# EAGLE schematic Schematic (EAGLE 9.6.0)
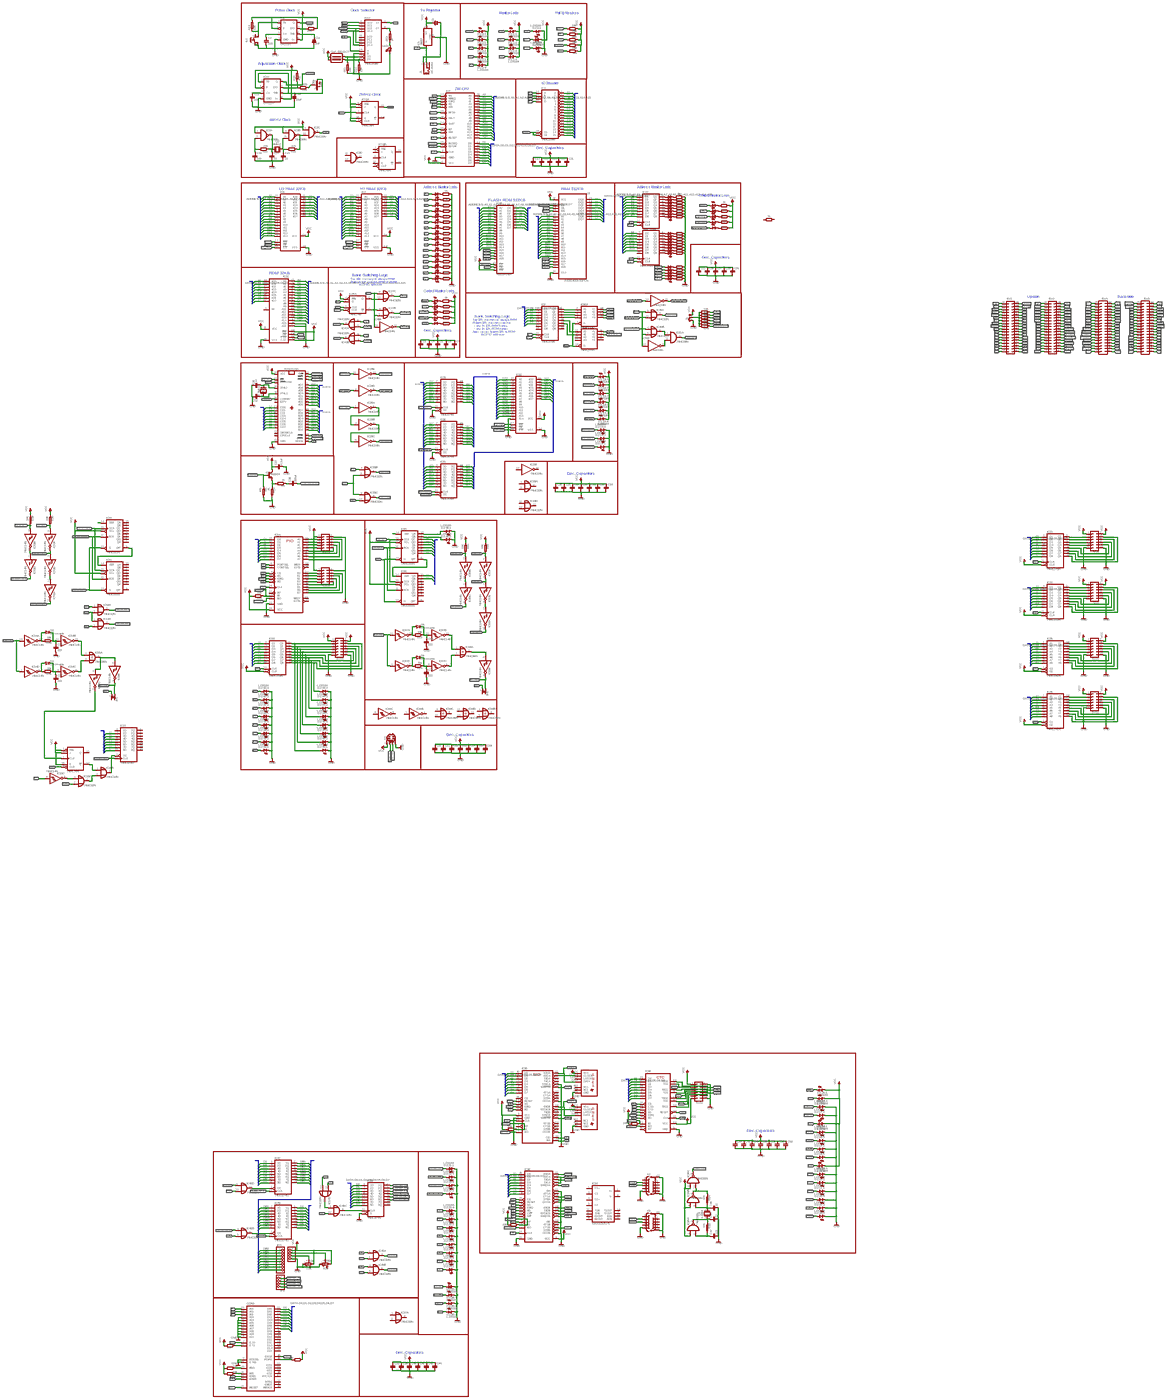
[diagram p0: schematic, sheet 1, overview]
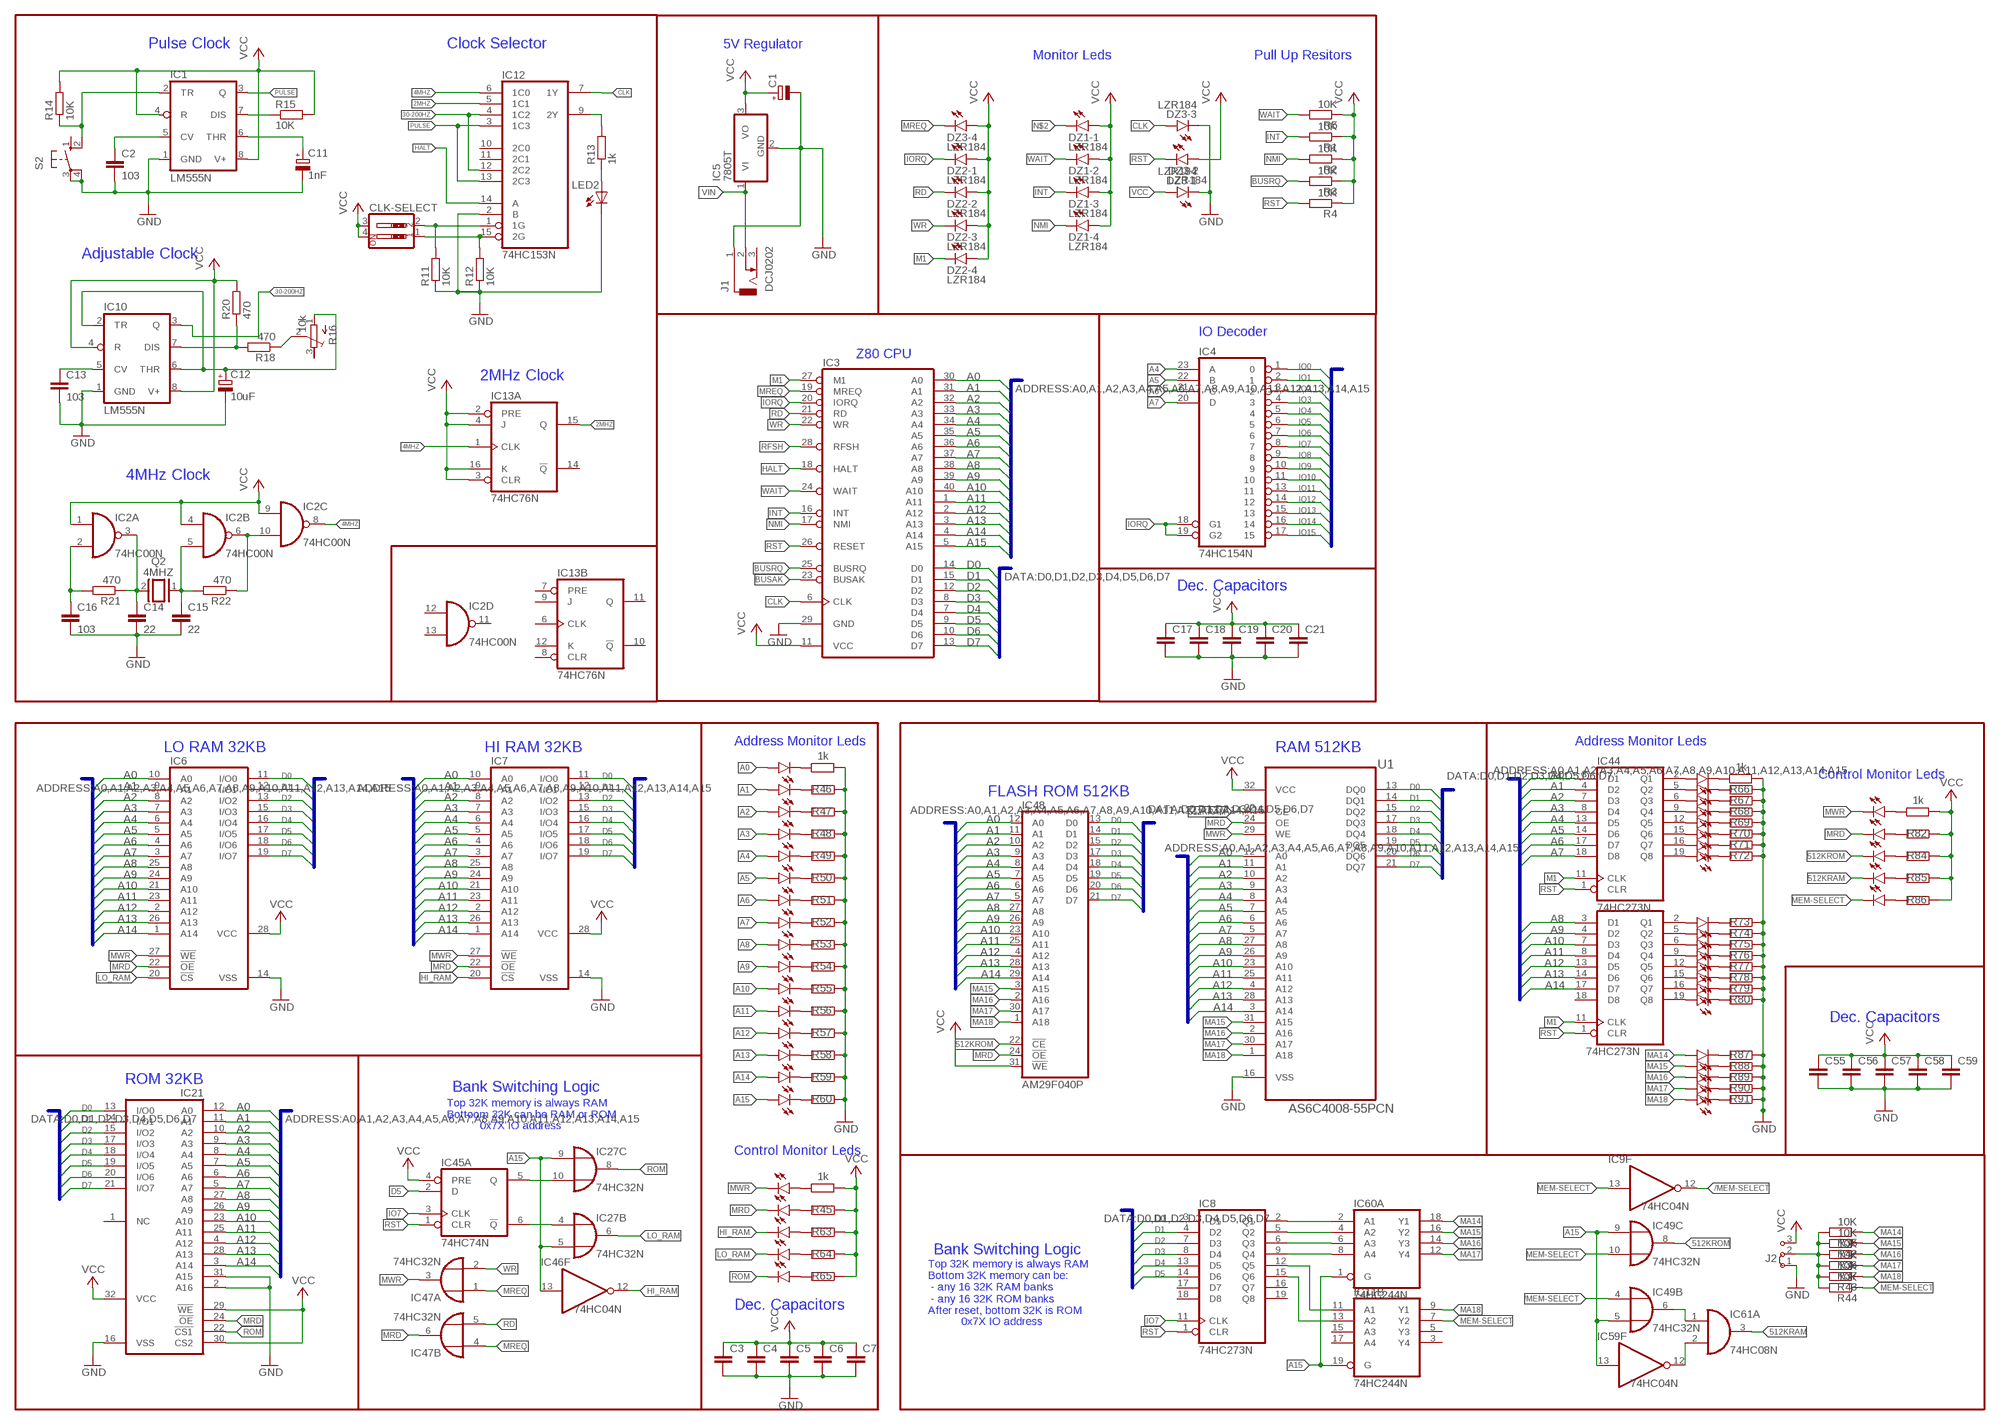
[diagram p1: schematic, sheet 1, part 1 of 7]
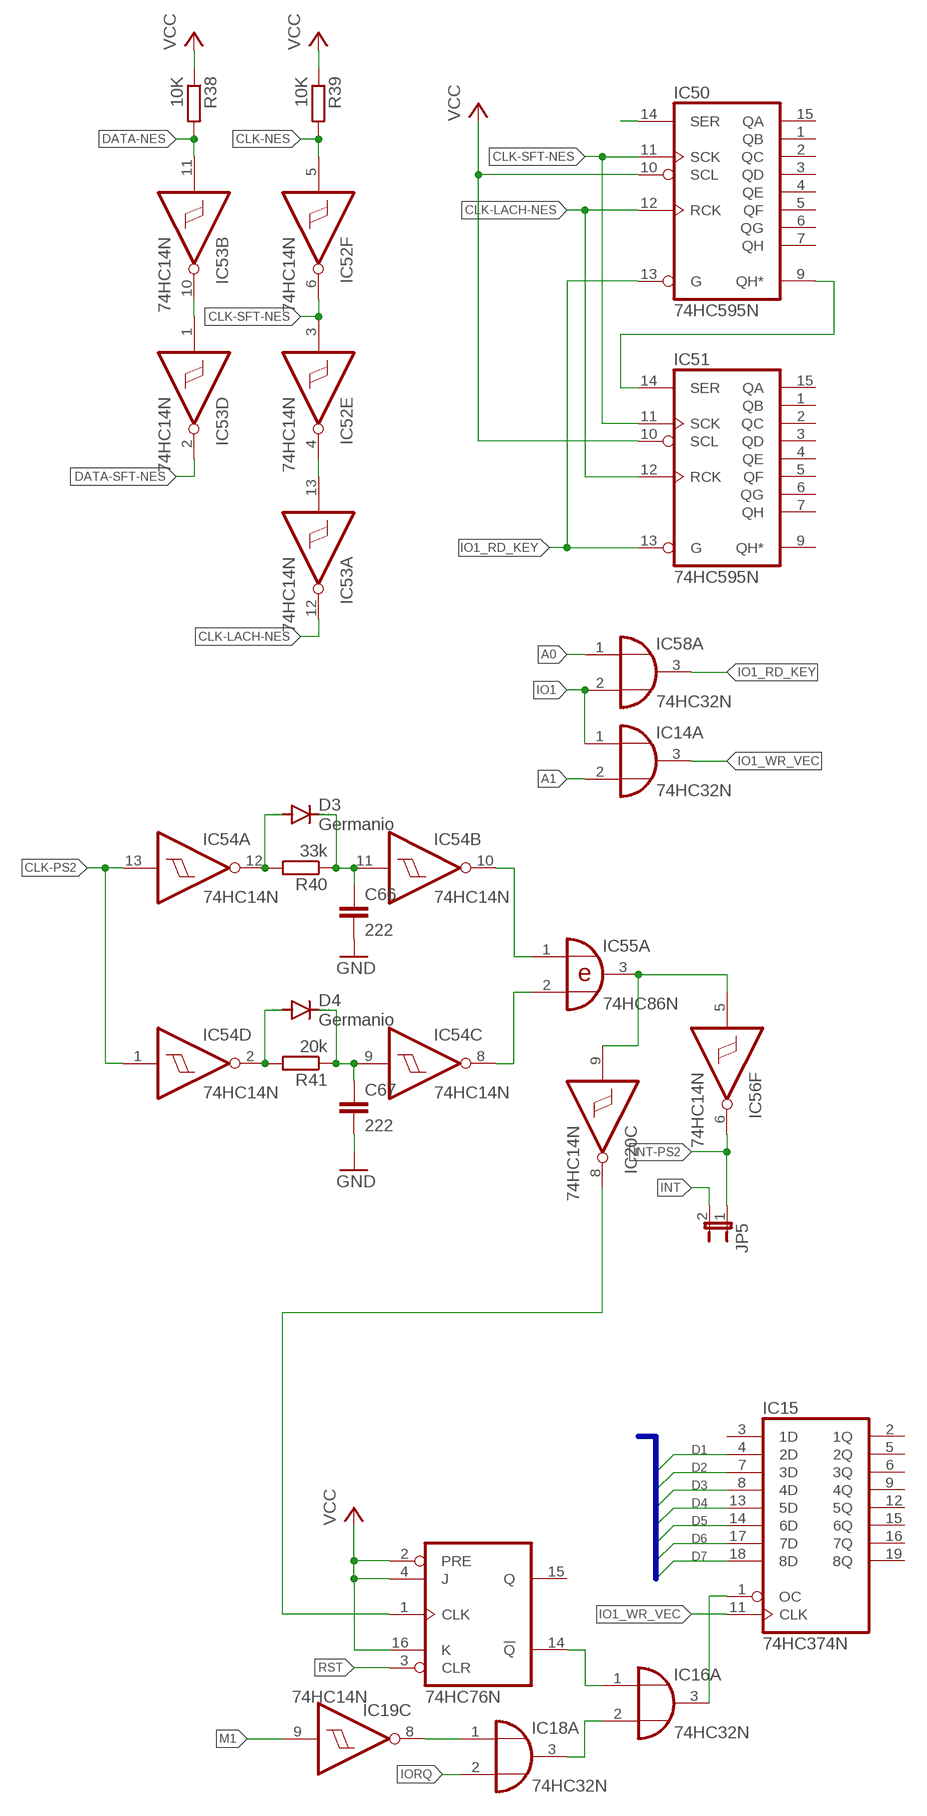
[diagram p2: schematic, sheet 1, part 2 of 7]
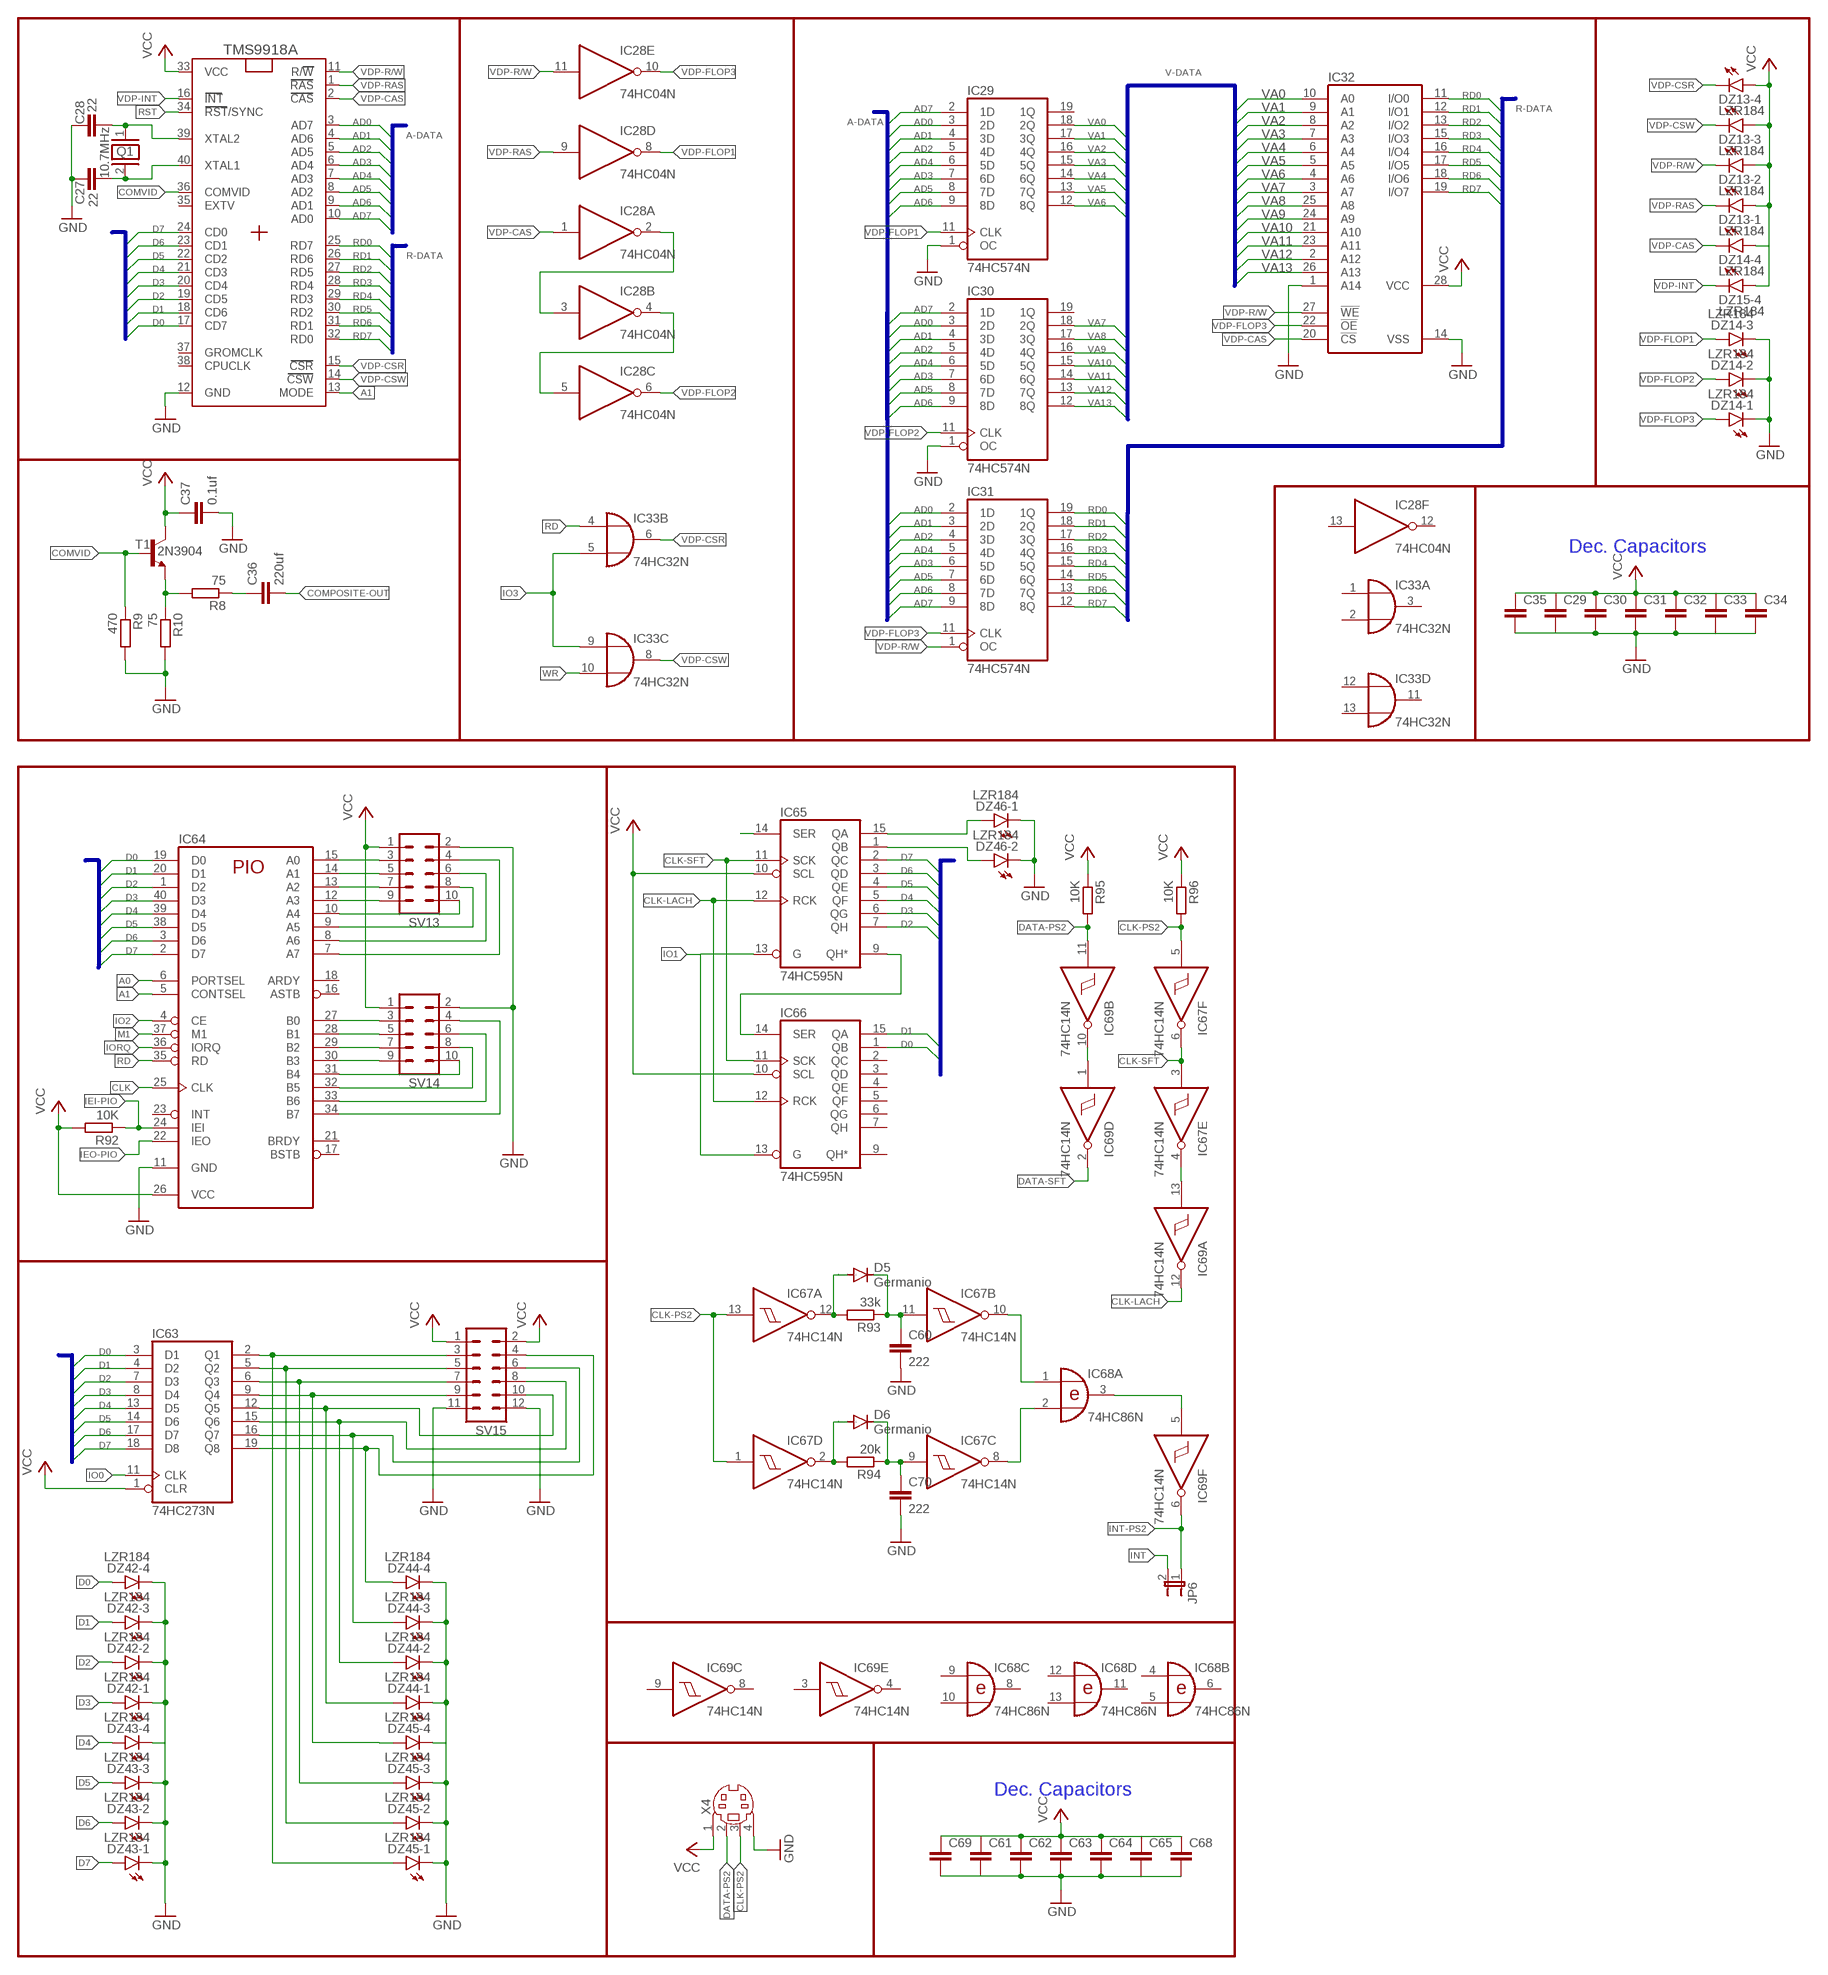
[diagram p3: schematic, sheet 1, part 3 of 7]
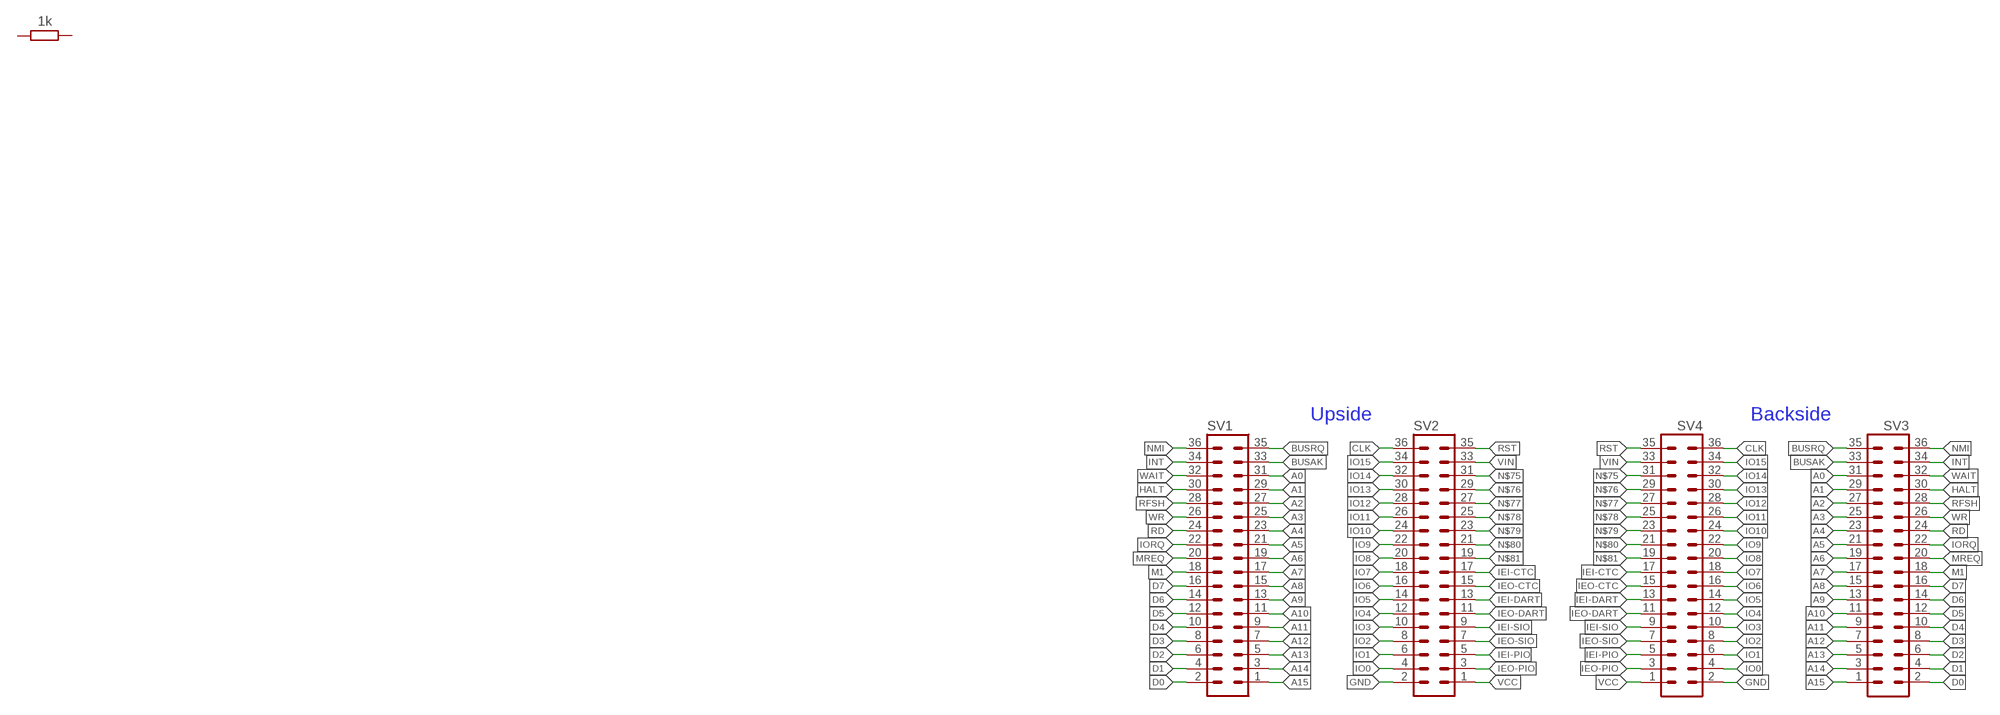
[diagram p4: schematic, sheet 1, part 4 of 7]
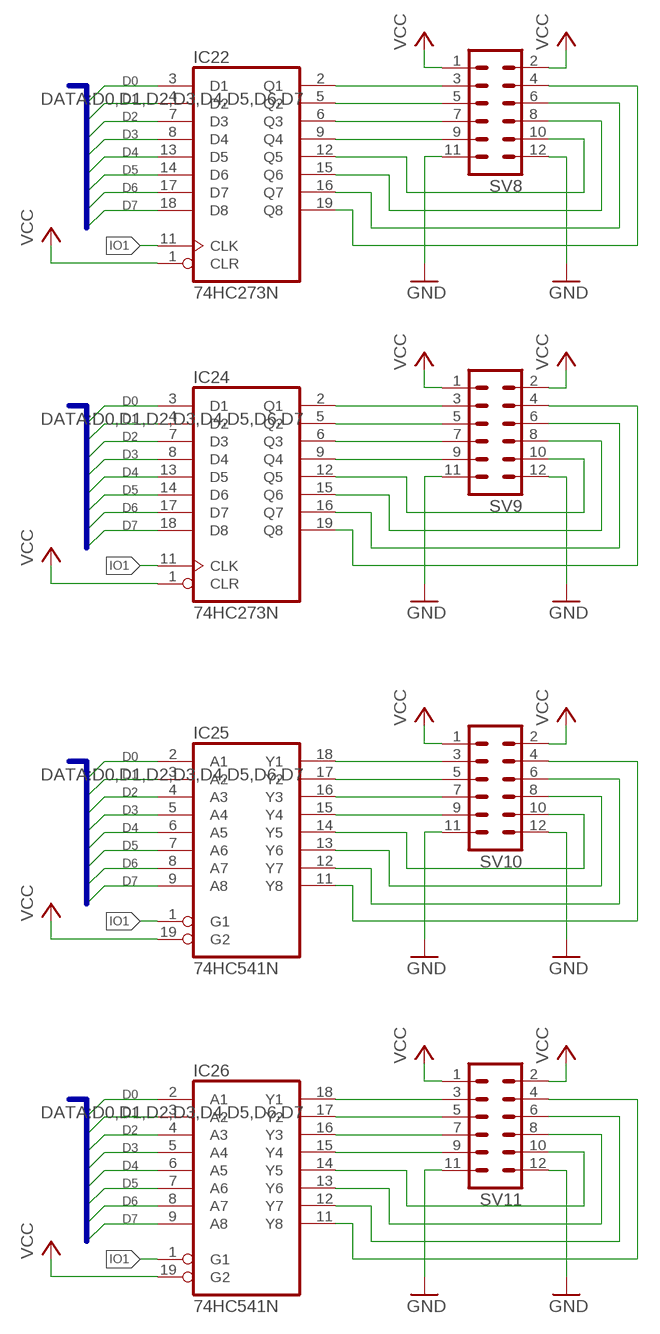
[diagram p5: schematic, sheet 1, part 5 of 7]
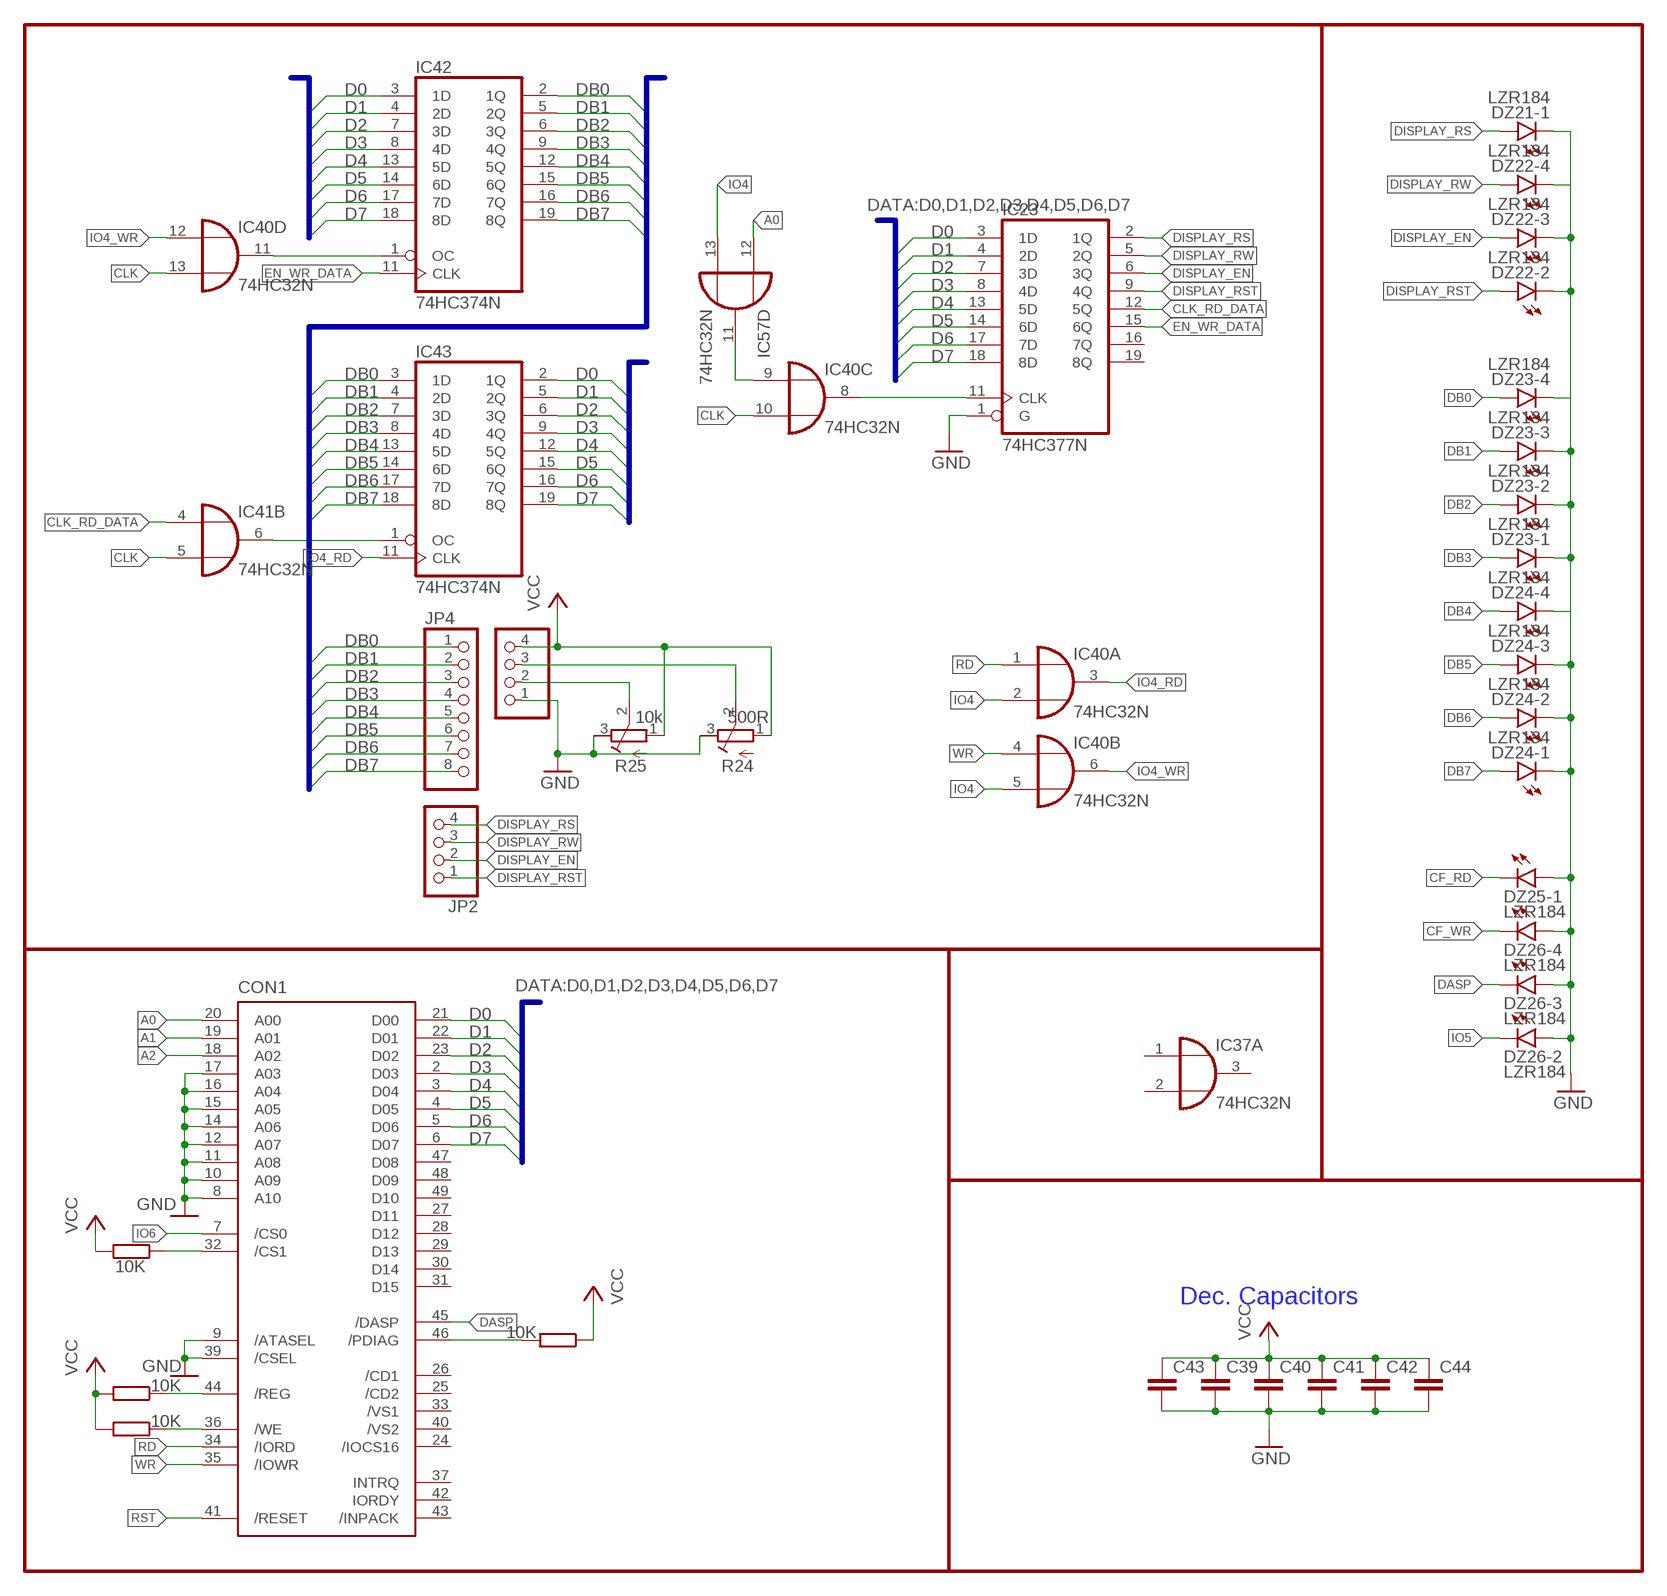
[diagram p6: schematic, sheet 1, part 6 of 7]
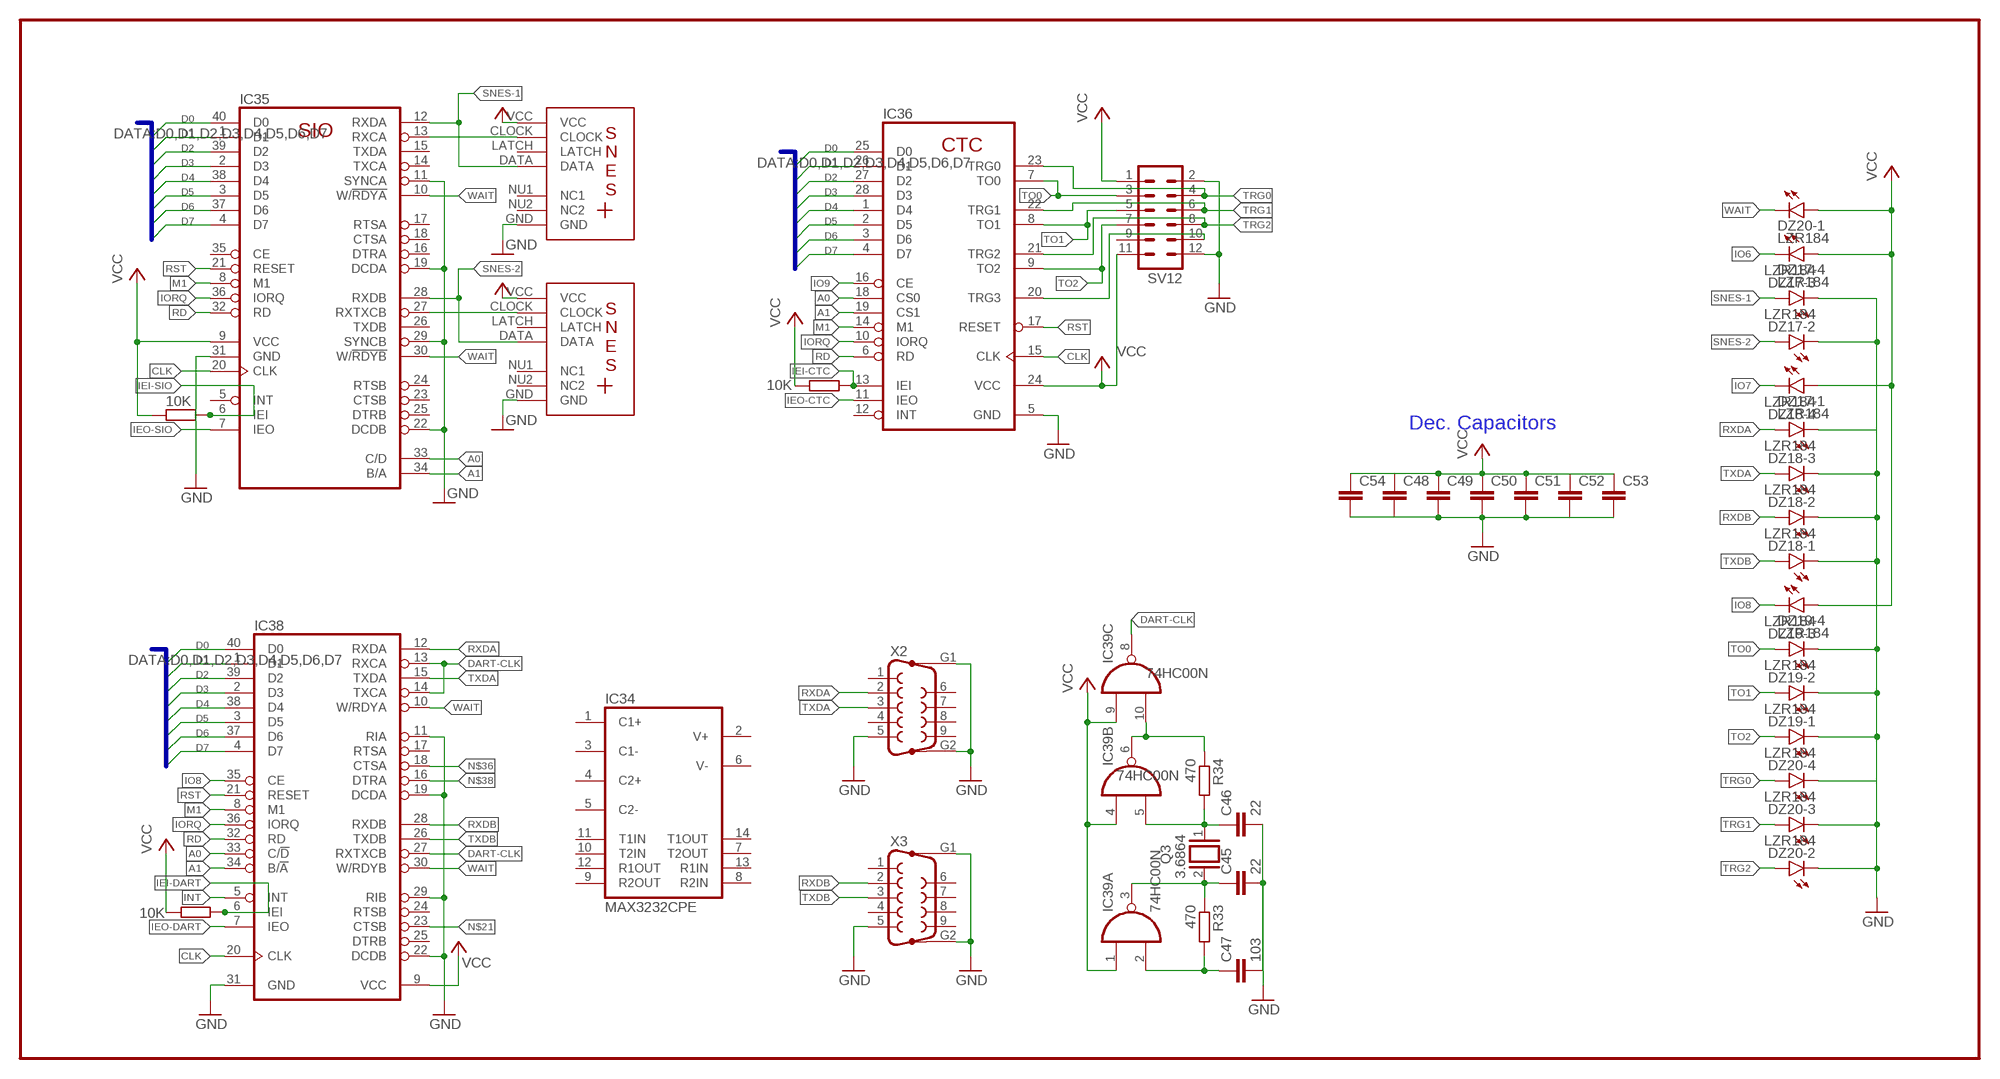
[diagram p7: schematic, sheet 1, part 7 of 7]

## Parts
C1  CPOL-EUE5-6  [E5-6]
C2  103  C2.5/2  [C2.5-2]
C3  C2.5/2  [C2.5-2]
C4  C2.5/2  [C2.5-2]
C5  C2.5/2  [C2.5-2]
C6  C2.5/2  [C2.5-2]
C7  C2.5/2  [C2.5-2]
C11  1nF  CPOL-EUE2.5-6  [E2,5-6]
C12  10uF  CPOL-EUE2.5-6  [E2,5-6]
C13  103  C2.5/2  [C2.5-2]
C14  22  C2.5/2  [C2.5-2]
C15  22  C2.5/2  [C2.5-2]
C16  103  C2.5/2  [C2.5-2]
C17  C2.5/2  [C2.5-2]
C18  C2.5/2  [C2.5-2]
C19  C2.5/2  [C2.5-2]
C20  C2.5/2  [C2.5-2]
C21  C2.5/2  [C2.5-2]
C27  22  C2.5/2  [C2.5-2]
C28  22  C2.5/2  [C2.5-2]
C29  C2.5/2  [C2.5-2]
C30  C2.5/2  [C2.5-2]
C31  C2.5/2  [C2.5-2]
C32  C2.5/2  [C2.5-2]
C33  C2.5/2  [C2.5-2]
C34  C2.5/2  [C2.5-2]
C35  C2.5/2  [C2.5-2]
C36  220uf  C2.5/2  [C2.5-2]
C37  0.1uf  C2.5/2  [C2.5-2]
C39  C2.5/2  [C2.5-2]
C40  C2.5/2  [C2.5-2]
C41  C2.5/2  [C2.5-2]
C42  C2.5/2  [C2.5-2]
C43  C2.5/2  [C2.5-2]
C44  C2.5/2  [C2.5-2]
C45  22  C2.5/2  [C2.5-2]
C46  22  C2.5/2  [C2.5-2]
C47  103  C2.5/2  [C2.5-2]
C48  C2.5/2  [C2.5-2]
C49  C2.5/2  [C2.5-2]
C50  C2.5/2  [C2.5-2]
C51  C2.5/2  [C2.5-2]
C52  C2.5/2  [C2.5-2]
C53  C2.5/2  [C2.5-2]
C54  C2.5/2  [C2.5-2]
C55  C2.5/2  [C2.5-2]
C56  C2.5/2  [C2.5-2]
C57  C2.5/2  [C2.5-2]
C58  C2.5/2  [C2.5-2]
C59  C2.5/2  [C2.5-2]
C60  222  C2.5/2  [C2.5-2]
C61  C2.5/2  [C2.5-2]
C62  C2.5/2  [C2.5-2]
C63  C2.5/2  [C2.5-2]
C64  C2.5/2  [C2.5-2]
C65  C2.5/2  [C2.5-2]
C66  222  C2.5/2  [C2.5-2]
C67  222  C2.5/2  [C2.5-2]
C68  C2.5/2  [C2.5-2]
C69  C2.5/2  [C2.5-2]
C70  222  C2.5/2  [C2.5-2]
CLK-SELECT  SW_DIP-2  [EDG-02]
CON1  CF-CARD-IDE_MODE  [MI20-50PD-SF]
D3  Germanio  BAV17  [DO35-10]
D4  Germanio  BAV17  [DO35-10]
D5  Germanio  BAV17  [DO35-10]
D6  Germanio  BAV17  [DO35-10]
DZ1  LZR184  [LZR184]
DZ2  LZR184  [LZR184]
DZ3  LZR184  [LZR184]
DZ4  LZR184  [LZR184]
DZ5  LZR184  [LZR184]
DZ6  LZR184  [LZR184]
DZ7  LZR184  [LZR184]
DZ8  LZR184  [LZR184]
DZ13  LZR184  [LZR184]
DZ14  LZR184  [LZR184]
DZ15  LZR184  [LZR184]
DZ17  LZR184  [LZR184]
DZ18  LZR184  [LZR184]
DZ19  LZR184  [LZR184]
DZ20  LZR184  [LZR184]
DZ21  LZR184  [LZR184]
DZ22  LZR184  [LZR184]
DZ23  LZR184  [LZR184]
DZ24  LZR184  [LZR184]
DZ25  LZR184  [LZR184]
DZ26  LZR184  [LZR184]
DZ27  LZR184  [LZR184]
DZ28  LZR184  [LZR184]
DZ29  LZR184  [LZR184]
DZ30  LZR184  [LZR184]
DZ31  LZR184  [LZR184]
DZ32  LZR184  [LZR184]
DZ33  LZR184  [LZR184]
DZ34  LZR184  [LZR184]
DZ35  LZR184  [LZR184]
DZ36  LZR184  [LZR184]
DZ37  LZR184  [LZR184]
DZ38  LZR184  [LZR184]
DZ39  LZR184  [LZR184]
DZ40  LZR184  [LZR184]
DZ41  LZR184  [LZR184]
DZ42  LZR184  [LZR184]
DZ43  LZR184  [LZR184]
DZ44  LZR184  [LZR184]
DZ45  LZR184  [LZR184]
DZ46  LZR184  [LZR184]
IC1  LM555N  [DIL08]
IC2  74HC00N  [DIL14]
IC3  Z80CPU  [DIL40]
IC4  74HC154N  [DIL24-6]
IC5  7805T  [TO220H]
IC6  62256P  [DIL28-6]
IC7  62256P  [DIL28-6]
IC8  74HC273N  [DIL20]
IC9  74HC04N  [DIL14]
IC10  LM555N  [DIL08]
IC11  74HC244N  [DIL20]
IC12  74HC153N  [DIL16]
IC13  74HC76N  [DIL16]
IC14  74HC32N  [DIL14]
IC15  74HC374N  [DIL20]
IC16  74HC32N  [DIL14]
IC17  74HC76N  [DIL16]
IC18  74HC32N  [DIL14]
IC19  74HC14N  [DIL14]
IC20  74HC14N  [DIL14]
IC21  628128P  [DIL32]
IC22  74HC273N  [DIL20]
IC23  74HC377N  [DIL20]
IC24  74HC273N  [DIL20]
IC25  74HC541N  [DIL20]
IC26  74HC541N  [DIL20]
IC27  74HC32N  [DIL14]
IC28  74HC04N  [DIL14]
IC29  74HC574N  [DIL20]
IC30  74HC574N  [DIL20]
IC31  74HC574N  [DIL20]
IC32  62256P  [DIL28-6]
IC33  74HC32N  [DIL14]
IC34  MAX3232CPE  [DIL16]
IC35  Z80SIO  [DIL40]
IC36  Z80CTC  [DIL28]
IC37  74HC32N  [DIL14]
IC38  Z80DART  [DIL40]
IC39  74HC00N  [DIL14]
IC40  74HC32N  [DIL14]
IC41  74HC32N  [DIL14]
IC42  74HC374N  [DIL20]
IC43  74HC374N  [DIL20]
IC44  74HC273N  [DIL20]
IC45  74HC74N  [DIL14]
IC46  74HC04N  [DIL14]
IC47  74HC32N  [DIL14]
IC48  AM29F040P  [DIL32-3]
IC49  74HC32N  [DIL14]
IC50  74HC595N  [DIL16]
IC51  74HC595N  [DIL16]
IC52  74HC14N  [DIL14]
IC53  74HC14N  [DIL14]
IC54  74HC14N  [DIL14]
IC55  74HC86N  [DIL14]
IC56  74HC14N  [DIL14]
IC57  74HC32N  [DIL14]
IC58  74HC32N  [DIL14]
IC59  74HC04N  [DIL14]
IC60  74HC244N  [DIL20]
IC61  74HC08N  [DIL14]
IC62  74HC273N  [DIL20]
IC63  74HC273N  [DIL20]
IC64  Z80PIO  [DIL40]
IC65  74HC595N  [DIL16]
IC66  74HC595N  [DIL16]
IC67  74HC14N  [DIL14]
IC68  74HC86N  [DIL14]
IC69  74HC14N  [DIL14]
J1  DCJ0202  [DCJ0202]
J2  J2X2MM  [04C]
JP2  PINHD-1X4  [1X04]
JP3  PINHD-1X4  [1X04]
JP4  PINHD-1X8  [1X08]
JP5  JP1E  [JP1]
JP6  JP1E  [JP1]
LED2  LED3MM  [LED3MM]
Q1  10.7MHz  XTAL/S  [QS]
Q2  4MHZ  XTAL/S  [QS]
Q3  3.6864  XTAL/S  [QS]
R1  10K  R-EU_0204/7  [0204/7]
R2  10K  R-EU_0204/7  [0204/7]
R3  10K  R-EU_0204/7  [0204/7]
R4  10K  R-EU_0204/7  [0204/7]
R5  10K  R-EU_0204/7  [0204/7]
R6  1k  R-EU_0204/7  [0204/7]
R8  75  R-EU_0204/7  [0204/7]
R9  470  R-EU_0204/7  [0204/7]
R10  75  R-EU_0204/7  [0204/7]
R11  10K  R-EU_0204/7  [0204/7]
R12  10K  R-EU_0204/7  [0204/7]
R13  1k  R-EU_0204/7  [0204/7]
R14  10K  R-EU_0204/7  [0204/7]
R15  10K  R-EU_0204/7  [0204/7]
R16  10k  R-TRIMM64W  [RTRIM64W]
R18  470  R-EU_0204/7  [0204/7]
R20  470  R-EU_0204/7  [0204/7]
R21  470  R-EU_0204/7  [0204/7]
R22  470  R-EU_0204/7  [0204/7]
R24  500R  R-TRIMM64W  [RTRIM64W]
R25  10k  R-TRIMM64W  [RTRIM64W]
R26  10K  R-EU_0204/7  [0204/7]
R27  10K  R-EU_0204/7  [0204/7]
R28  10K  R-EU_0204/7  [0204/7]
R29  10K  R-EU_0204/7  [0204/7]
R30  10K  R-EU_0204/7  [0204/7]
R31  10K  R-EU_0204/7  [0204/7]
R32  10K  R-EU_0204/7  [0204/7]
R33  470  R-EU_0204/7  [0204/7]
R34  470  R-EU_0204/7  [0204/7]
R35  10K  R-EU_0204/7  [0204/7]
R36  10K  R-EU_0204/7  [0204/7]
R37  10K  R-EU_0204/7  [0204/7]
R38  10K  R-EU_0204/7  [0204/7]
R39  10K  R-EU_0204/7  [0204/7]
R40  33k  R-EU_0204/7  [0204/7]
R41  20k  R-EU_0204/7  [0204/7]
R42  10K  R-EU_0204/7  [0204/7]
R43  10K  R-EU_0204/7  [0204/7]
R44  10K  R-EU_0204/7  [0204/7]
R45  1k  R-EU_0204/7  [0204/7]
R46  1k  R-EU_0204/7  [0204/7]
R47  1k  R-EU_0204/7  [0204/7]
R48  1k  R-EU_0204/7  [0204/7]
R49  1k  R-EU_0204/7  [0204/7]
R50  1k  R-EU_0204/7  [0204/7]
R51  1k  R-EU_0204/7  [0204/7]
R52  1k  R-EU_0204/7  [0204/7]
R53  1k  R-EU_0204/7  [0204/7]
R54  1k  R-EU_0204/7  [0204/7]
R55  1k  R-EU_0204/7  [0204/7]
R56  1k  R-EU_0204/7  [0204/7]
R57  1k  R-EU_0204/7  [0204/7]
R58  1k  R-EU_0204/7  [0204/7]
R59  1k  R-EU_0204/7  [0204/7]
R60  1k  R-EU_0204/7  [0204/7]
R61  1k  R-EU_0204/7  [0204/7]
R62  1k  R-EU_0204/7  [0204/7]
R63  1k  R-EU_0204/7  [0204/7]
R64  1k  R-EU_0204/7  [0204/7]
R65  1k  R-EU_0204/7  [0204/7]
R66  1k  R-EU_0204/7  [0204/7]
R67  1k  R-EU_0204/7  [0204/7]
R68  1k  R-EU_0204/7  [0204/7]
R69  1k  R-EU_0204/7  [0204/7]
R70  1k  R-EU_0204/7  [0204/7]
R71  1k  R-EU_0204/7  [0204/7]
R72  1k  R-EU_0204/7  [0204/7]
R73  1k  R-EU_0204/7  [0204/7]
R74  1k  R-EU_0204/7  [0204/7]
R75  1k  R-EU_0204/7  [0204/7]
R76  1k  R-EU_0204/7  [0204/7]
R77  1k  R-EU_0204/7  [0204/7]
R78  1k  R-EU_0204/7  [0204/7]
R79  1k  R-EU_0204/7  [0204/7]
R80  1k  R-EU_0204/7  [0204/7]
R81  1k  R-EU_0204/7  [0204/7]
R82  1k  R-EU_0204/7  [0204/7]
R83  1k  R-EU_0204/7  [0204/7]
R84  1k  R-EU_0204/7  [0204/7]
R85  1k  R-EU_0204/7  [0204/7]
R86  1k  R-EU_0204/7  [0204/7]
R87  1k  R-EU_0204/7  [0204/7]
R88  1k  R-EU_0204/7  [0204/7]
R89  1k  R-EU_0204/7  [0204/7]
R90  1k  R-EU_0204/7  [0204/7]
R91  1k  R-EU_0204/7  [0204/7]
R92  10K  R-EU_0204/7  [0204/7]
R93  33k  R-EU_0204/7  [0204/7]
R94  20k  R-EU_0204/7  [0204/7]
R95  10K  R-EU_0204/7  [0204/7]
R96  10K  R-EU_0204/7  [0204/7]
S2  10-XX  [B3F-10XX]
SV1  MA18-2  [MA18-2]
SV2  MA18-2  [MA18-2]
SV3  MA18-2  [MA18-2]
SV4  MA18-2  [MA18-2]
SV8  MA06-2  [MA06-2]
SV9  MA06-2  [MA06-2]
SV10  MA06-2  [MA06-2]
SV11  MA06-2  [MA06-2]
SV12  MA06-2  [MA06-2]
SV13  MA05-2  [MA05-2]
SV14  MA05-2  [MA05-2]
SV15  MA06-2  [MA06-2]
T1  2N3904  [TO92]
U1  AS6C4008-55PCN  [DIP254P1524X393-32]
U$1  TMS9918A  [TMS1998A]
U$2  SNES-CONTROLLER  [PAK_SNES-CONTROLLER]
U$3  SNES-CONTROLLER  [PAK_SNES-CONTROLLER]
X2  F09VP  [F09VP]
X3  F09VP  [F09VP]
X4  MDIN04K  [MDIN04K]

## Nets
2MHZ: IC12.5(1C1) IC13.15(A:Q)
4MHZ: IC2.8(C:O) IC12.6(1C0) IC13.1(A:CLK)
30-200HZ: IC10.3(Q) IC12.4(1C2) IC12.12(2C2)
512KRAM: DZ38.K3(-3:C) IC61.3(A:O) U1.22(CE)
512KROM: DZ37.K4(-4:C) IC48.22(!CE) IC49.8(C:O)
/MEM-SELECT: IC9.12(F:O) IC49.4(B:I0)
A0: CON1.20(A00) DZ4.A4(-4:A) IC3.30(A0) IC6.10(A0) IC7.10(A0) IC21.12(A0) IC35.33(C/D) IC36.18(CS0) IC38.33(C/!D) IC44.3(D1) IC48.12(A0) IC57.12(D:I0) IC58.1(A:I0) IC64.6(PORTSEL) SV1.31 SV3.31 U1.12(A0)
A1: CON1.19(A01) DZ4.A3(-3:A) IC3.31(A1) IC6.9(A1) IC7.9(A1) IC14.2(A:I1) IC21.11(A1) IC35.34(B/A) IC36.19(CS1) IC38.34(B/!A) IC44.4(D2) IC48.11(A1) IC64.5(CONTSEL) SV1.29 SV3.29 U1.11(A1) U$1.13(MODE)
A2: CON1.18(A02) DZ4.A2(-2:A) IC3.32(A2) IC6.8(A2) IC7.8(A2) IC21.10(A2) IC44.7(D3) IC48.10(A2) SV1.27 SV3.27 U1.10(A2)
A3: DZ4.A1(-1:A) IC3.33(A3) IC6.7(A3) IC7.7(A3) IC21.9(A3) IC44.8(D4) IC48.9(A3) SV1.25 SV3.25 U1.9(A3)
A4: DZ5.A4(-4:A) IC3.34(A4) IC4.23(A) IC6.6(A4) IC7.6(A4) IC21.8(A4) IC44.13(D5) IC48.8(A4) SV1.23 SV3.23 U1.8(A4)
A5: DZ5.A3(-3:A) IC3.35(A5) IC4.22(B) IC6.5(A5) IC7.5(A5) IC21.7(A5) IC44.14(D6) IC48.7(A5) SV1.21 SV3.21 U1.7(A5)
A6: DZ5.A2(-2:A) IC3.36(A6) IC4.21(C) IC6.4(A6) IC7.4(A6) IC21.6(A6) IC44.17(D7) IC48.6(A6) SV1.19 SV3.19 U1.6(A6)
A7: DZ5.A1(-1:A) IC3.37(A7) IC4.20(D) IC6.3(A7) IC7.3(A7) IC21.5(A7) IC44.18(D8) IC48.5(A7) SV1.17 SV3.17 U1.5(A7)
A8: DZ6.A4(-4:A) IC3.38(A8) IC6.25(A8) IC7.25(A8) IC21.27(A8) IC48.27(A8) IC62.3(D1) SV1.15 SV3.15 U1.27(A8)
A9: DZ6.A3(-3:A) IC3.39(A9) IC6.24(A9) IC7.24(A9) IC21.26(A9) IC48.26(A9) IC62.4(D2) SV1.13 SV3.13 U1.26(A9)
A10: DZ6.A2(-2:A) IC3.40(A10) IC6.21(A10) IC7.21(A10) IC21.23(A10) IC48.23(A10) IC62.7(D3) SV1.11 SV3.11 U1.23(A10)
A11: DZ6.A1(-1:A) IC3.1(A11) IC6.23(A11) IC7.23(A11) IC21.25(A11) IC48.25(A11) IC62.8(D4) SV1.9 SV3.9 U1.25(A11)
A12: DZ7.A4(-4:A) IC3.2(A12) IC6.2(A12) IC7.2(A12) IC21.4(A12) IC48.4(A12) IC62.13(D5) SV1.7 SV3.7 U1.4(A12)
A13: DZ7.A3(-3:A) IC3.3(A13) IC6.26(A13) IC7.26(A13) IC21.28(A13) IC48.28(A13) IC62.14(D6) SV1.5 SV3.5 U1.28(A13)
A14: DZ7.A2(-2:A) IC3.4(A14) IC6.1(A14) IC7.1(A14) IC21.3(A14) IC48.29(A14) IC62.17(D7) SV1.3 SV3.3 U1.3(A14)
A15: DZ7.A1(-1:A) IC3.5(A15) IC11.19(B:G) IC27.5(B:I1) IC27.9(C:I0) IC46.13(F:I) IC49.5(B:I1) IC49.9(C:I0) IC59.13(F:I) IC60.1(A:G) SV1.1 SV3.1
AD0: IC29.3(2D) IC30.3(2D) IC31.2(1D) U$1.3(AD7)
AD1: IC29.4(3D) IC30.4(3D) IC31.3(2D) U$1.4(AD6)
AD2: IC29.5(4D) IC30.5(4D) IC31.4(3D) U$1.5(AD5)
AD3: IC29.7(6D) IC30.7(6D) IC31.6(5D) U$1.6(AD4)
AD4: IC29.6(5D) IC30.6(5D) IC31.5(4D) U$1.7(AD3)
AD5: IC29.8(7D) IC30.8(7D) IC31.7(6D) U$1.8(AD2)
AD6: IC29.9(8D) IC30.9(8D) IC31.8(7D) U$1.9(AD1)
AD7: IC29.2(1D) IC30.2(1D) IC31.9(8D) U$1.10(AD0)
BUSAK: IC3.23(BUSAK) SV1.33 SV3.33
BUSRQ: IC3.25(BUSRQ) R3.2 SV1.35 SV3.35
CF_RD: DZ25.K1(-1:C)
CF_WR: DZ26.K4(-4:C)
CLK: DZ3.A3(-3:A) IC3.6(CLK) IC12.7(1Y) IC35.20(CLK) IC36.15(CLK) IC38.20(CLK) IC40.10(C:I1) IC40.13(D:I1) IC41.5(B:I1) IC64.25(CLK) SV2.36 SV4.36
CLK-LACH: IC65.12(RCK) IC66.12(RCK) IC69.12(A:O)
CLK-LACH-NES: IC50.12(RCK) IC51.12(RCK) IC53.12(A:O)
CLK-NES: IC52.5(F:I) R39.2
CLK-PS2: IC54.1(D:I) IC54.13(A:I) IC67.1(D:I) IC67.5(F:I) IC67.13(A:I) R96.2 X4.3
CLK-SFT: IC65.11(SCK) IC66.11(SCK) IC67.3(E:I) IC67.6(F:O)
CLK-SFT-NES: IC50.11(SCK) IC51.11(SCK) IC52.3(E:I) IC52.6(F:O)
CLK_RD_DATA: IC23.12(5Q) IC41.4(B:I0)
COMPOSITE-OUT: C36.2
COMVID: R9.1 T1.2(B) U$1.36(COMVID)
D0: CON1.21(D00) DZ42.A4(-4:A) IC3.14(D0) IC6.11(I/O0) IC7.11(I/O0) IC8.3(D1) IC21.13(I/O0) IC22.3(D1) IC23.3(1D) IC24.3(D1) IC25.2(A1) IC26.2(A1) IC35.40(D0) IC36.25(D0) IC38.40(D0) IC42.3(1D) IC43.2(1Q) IC48.13(D0) IC63.3(D1) IC64.19(D0) IC66.1(QB) SV1.2 SV3.2 U1.13(DQ0) U$1.17(CD7)
D1: CON1.22(D01) DZ42.A3(-3:A) IC3.15(D1) IC6.12(I/O1) IC7.12(I/O1) IC8.4(D2) IC15.4(2D) IC21.14(I/O1) IC22.4(D2) IC23.4(2D) IC24.4(D2) IC25.3(A2) IC26.3(A2) IC35.1(D1) IC36.26(D1) IC38.1(D1) IC42.4(2D) IC43.5(2Q) IC48.14(D1) IC63.4(D2) IC64.20(D1) IC66.15(QA) SV1.4 SV3.4 U1.14(DQ1) U$1.18(CD6)
D2: CON1.23(D02) DZ42.A2(-2:A) IC3.12(D2) IC6.13(I/O2) IC7.13(I/O2) IC8.7(D3) IC15.7(3D) IC21.15(I/O2) IC22.7(D3) IC23.7(3D) IC24.7(D3) IC25.4(A3) IC26.4(A3) IC35.39(D2) IC36.27(D2) IC38.39(D2) IC42.7(3D) IC43.6(3Q) IC48.15(D2) IC63.7(D3) IC64.1(D2) IC65.7(QH) SV1.6 SV3.6 U1.15(DQ2) U$1.19(CD5)
D3: CON1.2(D03) DZ42.A1(-1:A) IC3.8(D3) IC6.15(I/O3) IC7.15(I/O3) IC8.8(D4) IC15.8(4D) IC21.17(I/O3) IC22.8(D4) IC23.8(4D) IC24.8(D4) IC25.5(A4) IC26.5(A4) IC35.2(D3) IC36.28(D3) IC38.2(D3) IC42.8(4D) IC43.9(4Q) IC48.17(D3) IC63.8(D4) IC64.40(D3) IC65.6(QG) SV1.8 SV3.8 U1.17(DQ3) U$1.20(CD4)
D4: CON1.3(D04) DZ43.A4(-4:A) IC3.7(D4) IC6.16(I/O4) IC7.16(I/O4) IC8.13(D5) IC15.13(5D) IC21.18(I/O4) IC22.13(D5) IC23.13(5D) IC24.13(D5) IC25.6(A5) IC26.6(A5) IC35.38(D4) IC36.1(D4) IC38.38(D4) IC42.13(5D) IC43.12(5Q) IC48.18(D4) IC63.13(D5) IC64.39(D4) IC65.5(QF) SV1.10 SV3.10 U1.18(DQ4) U$1.21(CD3)
D5: CON1.4(D05) DZ43.A3(-3:A) IC3.9(D5) IC6.17(I/O5) IC7.17(I/O5) IC8.14(D6) IC15.14(6D) IC21.19(I/O5) IC22.14(D6) IC23.14(6D) IC24.14(D6) IC25.7(A6) IC26.7(A6) IC35.3(D5) IC36.2(D5) IC38.3(D5) IC42.14(6D) IC43.15(6Q) IC45.2(A:D) IC48.19(D5) IC63.14(D6) IC64.38(D5) IC65.4(QE) SV1.12 SV3.12 U1.19(DQ5) U$1.22(CD2)
D6: CON1.5(D06) DZ43.A2(-2:A) IC3.10(D6) IC6.18(I/O6) IC7.18(I/O6) IC15.17(7D) IC21.20(I/O6) IC22.17(D7) IC23.17(7D) IC24.17(D7) IC25.8(A7) IC26.8(A7) IC35.37(D6) IC36.3(D6) IC38.37(D6) IC42.17(7D) IC43.16(7Q) IC48.20(D6) IC63.17(D7) IC64.3(D6) IC65.3(QD) SV1.14 SV3.14 U1.20(DQ6) U$1.23(CD1)
D7: CON1.6(D07) DZ43.A1(-1:A) IC3.13(D7) IC6.19(I/O7) IC7.19(I/O7) IC15.18(8D) IC21.21(I/O7) IC22.18(D8) IC23.18(8D) IC24.18(D8) IC25.9(A8) IC26.9(A8) IC35.4(D7) IC36.4(D7) IC38.4(D7) IC42.18(8D) IC43.19(8Q) IC48.21(D7) IC63.18(D8) IC64.2(D7) IC65.2(QC) SV1.16 SV3.16 U1.21(DQ7) U$1.24(CD0)
DART-CLK: IC38.13(RXCA) IC38.14(TXCA) IC38.27(RXTXCB) IC39.8(C:O)
DASP: CON1.45(/DASP) DZ26.K3(-3:C)
DATA-NES: IC53.11(B:I) R38.2
DATA-PS2: IC69.11(B:I) R95.2 X4.2
DATA-SFT: IC69.2(D:O)
DATA-SFT-NES: IC53.2(D:O)
DB0: DZ23.A4(-4:A) IC42.2(1Q) IC43.3(1D) JP4.1
DB1: DZ23.A3(-3:A) IC42.5(2Q) IC43.4(2D) JP4.2
DB2: DZ23.A2(-2:A) IC42.6(3Q) IC43.7(3D) JP4.3
DB3: DZ23.A1(-1:A) IC42.9(4Q) IC43.8(4D) JP4.4
DB4: DZ24.A4(-4:A) IC42.12(5Q) IC43.13(5D) JP4.5
DB5: DZ24.A3(-3:A) IC42.15(6Q) IC43.14(6D) JP4.6
DB6: DZ24.A2(-2:A) IC42.16(7Q) IC43.17(7D) JP4.7
DB7: DZ24.A1(-1:A) IC42.19(8Q) IC43.18(8D) JP4.8
DISPLAY_EN: DZ22.A3(-3:A) IC23.6(3Q) JP2.2
DISPLAY_RS: DZ21.A1(-1:A) IC23.2(1Q) JP2.4
DISPLAY_RST: DZ22.A2(-2:A) IC23.9(4Q) JP2.1
DISPLAY_RW: DZ22.A4(-4:A) IC23.5(2Q) JP2.3
EN_WR_DATA: IC23.15(6Q) IC42.11(CLK)
GND: C1.- C2.2 C3.2 C4.2 C5.2 C6.2 C7.2 C11.- C12.- C13.2 C14.2 C15.2 C16.2 C17.2 C18.2 C19.2 C20.2 C21.2 C27.1 C28.1 C37.2 C45.2 C46.2 C47.2 C55.2 C56.2 C57.2 C58.2 C59.2 C60.2 C66.2 C67.2 C70.2 CON1.8(A10) CON1.9(/ATASEL) CON1.10(A09) CON1.11(A08) CON1.12(A07) CON1.14(A06) CON1.15(A05) CON1.16(A04) CON1.17(A03) CON1.39(/CSEL) DZ3.K1(-1:C) DZ3.K3(-3:C) DZ14.K1(-1:C) DZ14.K2(-2:C) DZ14.K3(-3:C) DZ21.K1(-1:C) DZ22.K2(-2:C) DZ22.K3(-3:C) DZ22.K4(-4:C) DZ23.K1(-1:C) DZ23.K2(-2:C) DZ23.K3(-3:C) DZ23.K4(-4:C) DZ24.K1(-1:C) DZ24.K2(-2:C) DZ24.K3(-3:C) DZ24.K4(-4:C) DZ25.A1(-1:A) DZ26.A2(-2:A) DZ26.A3(-3:A) DZ26.A4(-4:A) DZ46.K1(-1:C) DZ46.K2(-2:C) IC1.1(GND) IC3.29(GND) IC5.2(GND) IC6.14(VSS) IC7.14(VSS) IC10.1(GND) IC12.2(B) IC21.2(A16) IC21.16(VSS) IC21.31(A15) IC23.1(G) IC29.1(OC) IC30.1(OC) IC32.1(A14) IC32.14(VSS) IC35.11(SYNCA) IC35.19(DCDA) IC35.22(DCDB) IC35.29(SYNCB) IC35.31(GND) IC36.5(GND) IC38.11(RIA) IC38.19(DCDA) IC38.22(DCDB) IC38.29(RIB) IC38.31(GND) IC64.11(GND) J1.1 J2.1 JP3.1 LED2.K(C) R9.2 R10.2 R11.1 R12.1 R24.3(E) R25.3(E) R46.1 R47.1 R48.1 R49.1 R50.1 R51.1 R52.1 R53.1 R54.1 R55.1 R56.1 R57.1 R58.1 R59.1 R60.1 R61.2 R66.1 R67.1 R68.1 R69.1 R70.1 R71.1 R72.1 R73.1 R74.1 R75.1 R76.1 R77.1 R78.1 R79.1 R80.1 R81.2 R87.1 R88.1 R89.1 R90.1 R91.1 S2.3(P) S2.4(P1) SV2.2 SV4.2 SV8.11 SV8.12 SV9.11 SV9.12 SV10.11 SV10.12 SV11.11 SV11.12 SV12.2 SV12.12 SV13.2 SV14.2 SV15.11 SV15.12 U1.16(VSS) U$1.12(GND) U$2.GND U$3.GND X2.5 X2.G1 X2.G2 X3.5 X3.G1 X3.G2 X4.4
GND1: C39.2 C40.2 C41.2 C42.2 C43.2 C44.2 C61.2 C62.2 C63.2 C64.2 C65.2 C68.2 C69.2 ; supply symbol labelled GND
GND4: DZ17.K2(-2:C) DZ17.K3(-3:C) DZ18.K1(-1:C) DZ18.K2(-2:C) DZ18.K3(-3:C) DZ18.K4(-4:C) DZ19.K1(-1:C) DZ19.K2(-2:C) DZ19.K3(-3:C) DZ20.K2(-2:C) DZ20.K3(-3:C) DZ20.K4(-4:C) ; supply symbol labelled GND
GND5: DZ42.K1(-1:C) DZ42.K2(-2:C) DZ42.K3(-3:C) DZ42.K4(-4:C) DZ43.K1(-1:C) DZ43.K2(-2:C) DZ43.K3(-3:C) DZ43.K4(-4:C) DZ44.K1(-1:C) DZ44.K2(-2:C) DZ44.K3(-3:C) DZ44.K4(-4:C) DZ45.K1(-1:C) DZ45.K2(-2:C) DZ45.K3(-3:C) DZ45.K4(-4:C) ; supply symbol labelled GND
GND6: C29.2 C30.2 C31.2 C32.2 C33.2 C34.2 C35.2 C48.2 C49.2 C50.2 C51.2 C52.2 C53.2 C54.2 ; supply symbol labelled GND
HALT: IC3.18(HALT) IC12.14(A) SV1.30 SV3.30
HI_RAM: DZ29.K4(-4:C) IC7.20(!CS) IC46.12(F:O)
IEI-CTC: IC36.13(IEI) R31.1 SV2.17 SV4.17
IEI-DART: IC38.6(IEI) R30.1 SV2.13 SV4.13
IEI-PIO: IC64.24(IEI) R92.1 SV2.5 SV4.5
IEI-SIO: IC35.6(IEI) R32.1 SV2.9 SV4.9
IEO-CTC: IC36.11(IEO) SV2.15 SV4.15
IEO-DART: IC38.7(IEO) SV2.11 SV4.11
IEO-PIO: IC64.22(IEO) SV2.3 SV4.3
IEO-SIO: IC35.7(IEO) SV2.7 SV4.7
INT: DZ1.K3(-3:C) IC3.16(INT) IC38.5(INT) JP5.2 JP6.2 R1.2 SV1.34 SV3.34
INT-PS2: IC56.6(F:O) IC69.6(F:O) JP5.1 JP6.1
IO0: IC4.1 IC63.11(CLK) SV2.4 SV4.4
IO1: IC4.2 IC14.1(A:I0) IC22.11(CLK) IC24.11(CLK) IC25.1(G1) IC26.1(G1) IC58.2(A:I1) IC65.13(G) IC66.13(G) SV2.6 SV4.6
IO1_RD_KEY: IC50.13(G) IC51.13(G) IC58.3(A:O)
IO1_WR_VEC: IC14.3(A:O) IC15.11(CLK)
IO2: IC4.3 IC64.4(CE) SV2.8 SV4.8
IO3: IC4.4 IC33.5(B:I1) IC33.9(C:I0) SV2.10 SV4.10
IO4: IC4.5 IC40.2(A:I1) IC40.5(B:I1) IC57.13(D:I1) SV2.12 SV4.12
IO4_RD: IC40.3(A:O) IC43.11(CLK)
IO4_WR: IC40.6(B:O) IC40.12(D:I0)
IO5: DZ26.K2(-2:C) IC4.6 SV2.14 SV4.14
IO6: CON1.7(/CS0) DZ17.K4(-4:C) IC4.7 SV2.16 SV4.16
IO7: DZ17.K1(-1:C) IC4.8 IC8.11(CLK) IC45.3(A:CLK) SV2.18 SV4.18
IO8: DZ19.K4(-4:C) IC4.9 IC38.35(CE) SV2.20 SV4.20
IO9: IC4.10 IC36.16(CE) SV2.22 SV4.22
IO10: IC4.11 SV2.24 SV4.24
IO11: IC4.13 SV2.26 SV4.26
IO12: IC4.14 SV2.28 SV4.28
IO13: IC4.15 SV2.30 SV4.30
IO14: IC4.16 SV2.32 SV4.32
IO15: IC4.17 SV2.34 SV4.34
IORQ: DZ2.K1(-1:C) IC3.20(IORQ) IC4.18(G1) IC4.19(G2) IC18.2(A:I1) IC35.36(IORQ) IC36.10(IORQ) IC38.36(IORQ) IC64.36(IORQ) SV1.22 SV3.22
LO_RAM: DZ30.K3(-3:C) IC6.20(!CS) IC27.6(B:O)
M1: DZ2.K4(-4:C) IC3.27(M1) IC19.9(C:I) IC35.8(M1) IC36.14(M1) IC38.8(M1) IC44.11(CLK) IC62.11(CLK) IC64.37(M1) SV1.18 SV3.18
MA14: DZ40.A4(-4:A) IC60.18(A:Y1) R35.1
MA15: DZ40.A3(-3:A) IC48.3(A15) IC60.16(A:Y2) R42.1 U1.31(A15)
MA16: DZ40.A2(-2:A) IC48.2(A16) IC60.14(A:Y3) R36.1 U1.2(A16)
MA17: DZ40.A1(-1:A) IC48.30(A17) IC60.12(A:Y4) R37.1 U1.30(A17)
MA18: DZ41.A4(-4:A) IC11.9(B:Y1) IC48.1(A18) R43.1 U1.1(A18)
MEM-SELECT: DZ39.K2(-2:C) IC9.13(F:I) IC11.7(B:Y2) IC49.10(C:I1) R44.1
MRD: DZ27.K3(-3:C) DZ36.K3(-3:C) IC6.22(!OE) IC7.22(!OE) IC21.24(!OE) IC47.6(B:O) IC48.24(!OE) U1.24(OE)
MREQ: DZ3.K4(-4:C) IC3.19(MREQ) IC47.1(A:I0) IC47.4(B:I0) SV1.20 SV3.20
MWR: DZ28.K4(-4:C) DZ35.K4(-4:C) IC6.27(!WE) IC7.27(!WE) IC47.3(A:O) U1.29(WE)
N$1: CON1.32(/CS1) R28.1
N$2: DZ1.K1(-1:C)
N$3: IC15.1(OC) IC16.3(A:O)
N$4: DZ28.A4(-4:A) R62.1
N$5: IC35.13(RXCA) U$2.CLOCK
N$6: IC8.2(Q1) IC60.2(A:A1)
N$7: CON1.46(/PDIAG) R29.2
N$8: IC8.5(Q2) IC60.4(A:A2)
N$9: IC8.6(Q3) IC60.6(A:A3)
N$10: IC8.9(Q4) IC60.8(A:A4)
N$11: J2.2 R35.2 R36.2 R37.2 R42.2 R43.2 R44.2
N$12: IC8.12(Q5) IC11.11(B:A1)
N$13: IC8.15(Q6) IC11.13(B:A2)
N$14: DZ4.K1(-1:C) R48.2
N$15: IC27.4(B:I0) IC45.6(A:!Q)
N$16: IC27.10(C:I1) IC45.5(A:Q)
N$17: CLK-SELECT.1 IC12.15(2G) R12.2
N$18: CLK-SELECT.2 IC12.1(1G) R11.2
N$19: LED2.A R13.1
N$20: IC12.9(2Y) R13.2
N$21: IC38.23(CTSB)
N$22: C11.+ IC1.6(THR)
N$23: C2.1 IC1.5(CV)
N$24: IC1.2(TR) R14.1 S2.2(S1)
N$25: C13.1 IC10.5(CV)
N$26: IC1.7(DIS) R15.1
N$27: IC10.7(DIS) R18.2 R20.1
N$28: C12.+ IC10.2(TR) IC10.6(THR) R16.1(A)
N$29: R16.2(S) R18.1
N$31: C14.1 IC2.3(A:O) Q2.2 R21.1
N$32: C15.1 IC2.5(B:I1) Q2.1 R22.2
N$33: C16.1 IC2.2(A:I1) R21.2
N$34: IC36.20(TRG3) SV12.10
N$35: IC2.6(B:O) IC2.10(C:I1) R22.1
N$36: IC38.18(CTSA)
N$37: C45.1 IC39.3(A:O) Q3.2 R33.1
N$38: IC38.16(DTRA)
N$39: C46.1 IC39.5(B:I1) Q3.1 R34.2
N$40: C47.1 IC39.2(A:I1) R33.2
N$41: IC39.6(B:O) IC39.10(C:I1) R34.1
N$42: IC35.27(RXTXCB) U$3.CLOCK
N$43: IC17.1(A:CLK) IC20.8(C:O)
N$44: IC16.1(A:I0) IC17.14(A:!Q)
N$45: IC16.2(A:I1) IC18.3(A:O)
N$46: IC18.1(A:I0) IC19.8(C:O)
N$75: SV2.31 SV4.31
N$76: SV2.29 SV4.29
N$77: SV2.27 SV4.27
N$78: SV2.25 SV4.25
N$79: SV2.23 SV4.23
N$80: SV2.21 SV4.21
N$81: SV2.19 SV4.19
N$82: IC50.9(QH*) IC51.14(SER)
N$83: IC50.14(SER)
N$84: D3.A IC54.12(A:O) R40.2
N$85: C66.1 D3.C IC54.11(B:I) R40.1
N$86: IC52.4(E:O) IC53.13(A:I)
N$87: IC53.1(D:I) IC53.10(B:O)
N$92: JP3.2 R25.2(S)
N$93: JP3.3 R24.2(S)
N$95: IC41.6(B:O) IC43.1(OC)
N$96: CON1.44(/REG) R27.1
N$97: IC40.11(D:O) IC42.1(OC)
N$98: CON1.36(/WE) R26.1
N$99: IC23.11(CLK) IC40.8(C:O)
N$100: D4.A IC54.2(D:O) R41.2
N$101: C67.1 D4.C IC54.9(C:I) R41.1
N$102: IC54.10(B:O) IC55.1(A:I0)
N$103: IC54.8(C:O) IC55.2(A:I1)
N$104: IC20.9(C:I) IC55.3(A:O) IC56.5(F:I)
N$105: IC22.2(Q1) SV8.3
N$106: DZ4.K2(-2:C) R47.2
N$107: DZ4.K3(-3:C) R46.2
N$108: IC22.5(Q2) SV8.5
N$109: IC22.6(Q3) SV8.7
N$110: IC22.9(Q4) SV8.9
N$111: IC22.12(Q5) SV8.10
N$112: IC22.15(Q6) SV8.8
N$113: IC22.16(Q7) SV8.6
N$114: IC22.19(Q8) SV8.4
N$115: IC24.2(Q1) SV9.3
N$116: IC24.5(Q2) SV9.5
N$117: IC24.6(Q3) SV9.7
N$118: IC24.9(Q4) SV9.9
N$119: IC24.12(Q5) SV9.10
N$120: IC24.15(Q6) SV9.8
N$121: IC24.16(Q7) SV9.6
N$122: IC24.19(Q8) SV9.4
N$123: IC25.18(Y1) SV10.3
N$124: IC25.17(Y2) SV10.5
N$125: IC25.16(Y3) SV10.7
N$126: IC25.15(Y4) SV10.9
N$127: IC25.14(Y5) SV10.10
N$128: IC25.13(Y6) SV10.8
N$129: IC25.12(Y7) SV10.6
N$130: IC25.11(Y8) SV10.4
N$131: IC26.18(Y1) SV11.3
N$132: IC26.17(Y2) SV11.5
N$133: IC26.16(Y3) SV11.7
N$134: IC26.15(Y4) SV11.9
N$135: IC26.14(Y5) SV11.10
N$136: IC26.13(Y6) SV11.8
N$137: IC26.12(Y7) SV11.6
N$138: IC26.11(Y8) SV11.4
N$139: IC28.2(A:O) IC28.3(B:I)
N$140: IC40.9(C:I0) IC57.11(D:O)
N$141: DZ4.K4(-4:C) R61.1
N$142: DZ5.K1(-1:C) R52.2
N$143: IC28.4(B:O) IC28.5(C:I)
N$144: C28.2 Q1.1 U$1.39(XTAL2)
N$145: C27.2 Q1.2 U$1.40(XTAL1)
N$146: R8.2 R10.1 T1.3(E)
N$147: C36.1 R8.1
N$148: DZ5.K2(-2:C) R51.2
N$149: DZ5.K3(-3:C) R50.2
N$150: DZ5.K4(-4:C) R49.2
N$151: DZ6.K1(-1:C) R56.2
N$152: DZ6.K2(-2:C) R55.2
N$153: DZ6.K3(-3:C) R54.2
N$154: DZ6.K4(-4:C) R53.2
N$155: DZ7.K1(-1:C) R60.2
N$156: DZ7.K2(-2:C) R59.2
N$157: DZ7.K3(-3:C) R58.2
N$158: DZ7.K4(-4:C) R57.2
N$159: DZ27.A3(-3:A) R45.2
N$160: DZ29.A4(-4:A) R63.2
N$161: DZ30.A3(-3:A) R64.2
N$162: DZ8.A2(-2:A) R65.2
N$163: DZ31.K1(-1:C) R68.2
N$164: DZ31.K2(-2:C) R67.2
N$165: DZ31.K3(-3:C) R66.2
N$166: DZ31.K4(-4:C) R81.1
N$167: DZ32.K1(-1:C) R72.2
N$168: DZ32.K2(-2:C) R71.2
N$169: DZ32.K3(-3:C) R70.2
N$170: DZ32.K4(-4:C) R69.2
N$171: DZ33.K1(-1:C) R76.2
N$172: DZ33.K2(-2:C) R75.2
N$173: DZ33.K3(-3:C) R74.2
N$174: DZ33.K4(-4:C) R73.2
N$175: DZ34.K1(-1:C) R80.2
N$176: DZ34.K2(-2:C) R79.2
N$177: DZ34.K3(-3:C) R78.2
N$178: DZ34.K4(-4:C) R77.2
N$179: DZ35.A4(-4:A) R83.1
N$180: DZ36.A3(-3:A) R82.2
N$181: DZ37.A4(-4:A) R84.2
N$182: DZ38.A3(-3:A) R85.2
N$183: DZ39.A2(-2:A) R86.2
N$184: DZ31.A1(-1:A) IC44.9(Q4)
N$185: DZ31.A2(-2:A) IC44.6(Q3)
N$186: DZ31.A3(-3:A) IC44.5(Q2)
N$187: DZ31.A4(-4:A) IC44.2(Q1)
N$188: DZ32.A1(-1:A) IC44.19(Q8)
N$189: DZ32.A2(-2:A) IC44.16(Q7)
N$190: DZ32.A3(-3:A) IC44.15(Q6)
N$191: DZ32.A4(-4:A) IC44.12(Q5)
N$192: DZ33.A1(-1:A) IC62.9(Q4)
N$193: DZ33.A2(-2:A) IC62.6(Q3)
N$194: DZ33.A3(-3:A) IC62.5(Q2)
N$195: DZ33.A4(-4:A) IC62.2(Q1)
N$196: DZ34.A1(-1:A) IC62.19(Q8)
N$197: DZ34.A2(-2:A) IC62.16(Q7)
N$198: DZ34.A3(-3:A) IC62.15(Q6)
N$199: DZ34.A4(-4:A) IC62.12(Q5)
N$200: DZ40.K1(-1:C) R90.2
N$201: DZ40.K2(-2:C) R89.2
N$202: DZ40.K3(-3:C) R88.2
N$203: DZ40.K4(-4:C) R87.2
N$205: DZ41.K4(-4:C) R91.2
N$206: IC64.14(A1) SV13.5
N$207: IC64.13(A2) SV13.7
N$208: IC64.12(A3) SV13.9
N$209: IC64.10(A4) SV13.10
N$210: IC64.9(A5) SV13.8
N$211: IC64.8(A6) SV13.6
N$212: IC64.7(A7) SV13.4
N$213: IC64.27(B0) SV14.3
N$214: IC64.28(B1) SV14.5
N$215: IC64.29(B2) SV14.7
N$216: IC64.30(B3) SV14.9
N$217: IC64.31(B4) SV14.10
N$218: IC64.32(B5) SV14.8
N$219: IC64.33(B6) SV14.6
N$220: IC64.34(B7) SV14.4
N$221: DZ45.A1(-1:A) IC63.2(Q1) SV15.3
N$222: DZ45.A2(-2:A) IC63.5(Q2) SV15.5
N$223: DZ45.A3(-3:A) IC63.6(Q3) SV15.7
N$224: IC63.9(Q4) SV15.9
N$225: DZ44.A1(-1:A) IC63.12(Q5) SV15.10
N$226: DZ44.A2(-2:A) IC63.15(Q6) SV15.8
N$227: DZ44.A3(-3:A) IC63.16(Q7) SV15.6
N$228: DZ44.A4(-4:A) IC63.19(Q8) SV15.4
N$229: DZ45.A4(-4:A)
N$230: IC65.9(QH*) IC66.14(SER)
N$231: D5.A IC67.12(A:O) R93.2
N$232: C60.1 D5.C IC67.11(B:I) R93.1
N$233: D6.A IC67.2(D:O) R94.2
N$234: C70.1 D6.C IC67.9(C:I) R94.1
N$235: IC67.10(B:O) IC68.1(A:I0)
N$236: IC67.8(C:O) IC68.2(A:I1)
N$237: IC67.4(E:O) IC69.13(A:I)
N$238: IC69.1(D:I) IC69.10(B:O)
N$239: IC65.14(SER)
N$240: DZ46.A1(-1:A) IC65.15(QA)
N$241: DZ46.A2(-2:A) IC65.1(QB)
N$242: IC68.3(A:O) IC69.5(F:I)
N$399: IC64.15(A0) SV13.3
NMI: DZ1.K4(-4:C) IC3.17(NMI) R2.2 SV1.36 SV3.36
PULSE: IC1.3(Q) IC12.3(1C3) IC12.13(2C3)
RAM-HI-BANK: IC59.12(F:O) IC61.2(A:I1)
RAM-LO-BANK: IC49.6(B:O) IC61.1(A:I0)
RD: CON1.34(/IORD) DZ2.K2(-2:C) IC3.21(RD) IC33.4(B:I0) IC35.32(RD) IC36.6(RD) IC38.32(RD) IC40.1(A:I0) IC47.5(B:I1) IC64.35(RD) SV1.24 SV3.24
RD0: IC31.19(1Q) IC32.11(I/O0) U$1.25(RD7)
RD1: IC31.18(2Q) IC32.12(I/O1) U$1.26(RD6)
RD2: IC31.17(3Q) IC32.13(I/O2) U$1.27(RD5)
RD3: IC31.16(4Q) IC32.15(I/O3) U$1.28(RD4)
RD4: IC31.15(5Q) IC32.16(I/O4) U$1.29(RD3)
RD5: IC31.14(6Q) IC32.17(I/O5) U$1.30(RD2)
RD6: IC31.13(7Q) IC32.18(I/O6) U$1.31(RD1)
RD7: IC31.12(8Q) IC32.19(I/O7) U$1.32(RD0)
RFSH: IC3.28(RFSH) SV1.28 SV3.28
ROM: DZ8.K2(-2:C) IC21.22(!CS1) IC27.8(C:O)
RST: CON1.41(/RESET) DZ3.K2(-2:C) IC3.26(RESET) IC8.1(CLR) IC17.3(A:CLR) IC35.21(RESET) IC36.17(RESET) IC38.21(RESET) IC44.1(CLR) IC45.1(A:CLR) IC62.1(CLR) R4.2 SV2.35 SV4.35 U$1.34(RST/SYNC)
RXDA: DZ18.A4(-4:A) IC38.12(RXDA) X2.2
RXDB: DZ18.A2(-2:A) IC38.28(RXDB) X3.2
SNES-1: DZ17.A3(-3:A) IC35.12(RXDA) U$2.DATA
SNES-2: DZ17.A2(-2:A) IC35.28(RXDB) U$3.DATA
TO0: DZ19.A3(-3:A) IC36.7(TO0) SV12.3
TO1: DZ19.A2(-2:A) IC36.8(TO1) SV12.5
TO2: DZ19.A1(-1:A) IC36.9(TO2) SV12.7
TRG0: DZ20.A4(-4:A) IC36.23(TRG0) SV12.4
TRG1: DZ20.A3(-3:A) IC36.22(TRG1) SV12.6
TRG2: DZ20.A2(-2:A) IC36.21(TRG2) SV12.8
TXDA: DZ18.A3(-3:A) IC38.15(TXDA) X2.3
TXDB: DZ18.A1(-1:A) IC38.26(TXDB) X3.3
VA0: IC29.18(2Q) IC32.10(A0)
VA1: IC29.17(3Q) IC32.9(A1)
VA2: IC29.16(4Q) IC32.8(A2)
VA3: IC29.15(5Q) IC32.7(A3)
VA4: IC29.14(6Q) IC32.6(A4)
VA5: IC29.13(7Q) IC32.5(A5)
VA6: IC29.12(8Q) IC32.4(A6)
VA7: IC30.18(2Q) IC32.3(A7)
VA8: IC30.17(3Q) IC32.25(A8)
VA9: IC30.16(4Q) IC32.24(A9)
VA10: IC30.15(5Q) IC32.21(A10)
VA11: IC30.14(6Q) IC32.23(A11)
VA12: IC30.13(7Q) IC32.2(A12)
VA13: IC30.12(8Q) IC32.26(A13)
VCC: C1.+ C3.1 C4.1 C5.1 C6.1 C7.1 C17.1 C18.1 C19.1 C20.1 C21.1 C37.1 C55.1 C56.1 C57.1 C58.1 C59.1 CLK-SELECT.3 CLK-SELECT.4 DZ1.A1(-1:A) DZ1.A2(-2:A) DZ1.A3(-3:A) DZ1.A4(-4:A) DZ2.A1(-1:A) DZ2.A2(-2:A) DZ2.A3(-3:A) DZ2.A4(-4:A) DZ3.A1(-1:A) DZ3.A2(-2:A) DZ3.A4(-4:A) DZ17.A1(-1:A) DZ17.A4(-4:A) DZ19.A4(-4:A) DZ20.A1(-1:A) IC1.4(R) IC1.8(V+) IC2.1(A:I0) IC2.4(B:I0) IC2.9(C:I0) IC3.11(VCC) IC5.3(VO) IC6.28(VCC) IC7.28(VCC) IC10.4(R) IC10.8(V+) IC13.2(A:PRE) IC13.3(A:CLR) IC13.4(A:J) IC13.16(A:K) IC17.2(A:PRE) IC17.4(A:J) IC17.16(A:K) IC21.29(!WE) IC21.30(CS2) IC21.32(VCC) IC22.1(CLR) IC24.1(CLR) IC25.19(G2) IC26.19(G2) IC32.28(VCC) IC35.9(VCC) IC36.24(VCC) IC38.9(VCC) IC39.1(A:I0) IC39.4(B:I0) IC39.9(C:I0) IC45.4(A:PRE) IC48.31(!WE) IC50.10(SCL) IC51.10(SCL) IC63.1(CLR) IC64.26(VCC) IC65.10(SCL) IC66.10(SCL) J2.3 JP3.4 R1.1 R2.1 R3.1 R4.1 R5.1 R14.2 R15.2 R20.2 R24.1(A) R25.1(A) R26.2 R27.2 R28.2 R29.1 R30.2 R31.2 R32.2 R38.1 R39.1 R45.1 R62.2 R63.1 R64.1 R65.1 R82.1 R83.2 R84.1 R85.1 R86.1 R92.2 R95.1 R96.1 SV2.1 SV4.1 SV8.1 SV8.2 SV9.1 SV9.2 SV10.1 SV10.2 SV11.1 SV11.2 SV12.1 SV12.11 SV13.1 SV14.1 SV15.1 SV15.2 T1.1(C) U1.32(VCC) U$1.33(VCC) U$2.VCC U$3.VCC X4.1
VCC1: C39.1 C40.1 C41.1 C42.1 C43.1 C44.1 C61.1 C62.1 C63.1 C64.1 C65.1 C68.1 C69.1 ; supply symbol labelled VCC
VCC2: DZ13.A1(-1:A) DZ13.A2(-2:A) DZ13.A3(-3:A) DZ13.A4(-4:A) DZ14.A4(-4:A) DZ15.A4(-4:A) ; supply symbol labelled VCC
VCC3: C29.1 C30.1 C31.1 C32.1 C33.1 C34.1 C35.1 C48.1 C49.1 C50.1 C51.1 C52.1 C53.1 C54.1 ; supply symbol labelled VCC
VDP-CAS: DZ14.K4(-4:C) IC28.1(A:I) IC32.20(!CS) U$1.2(CAS)
VDP-CSR: DZ13.K4(-4:C) IC33.6(B:O) U$1.15(CSR)
VDP-CSW: DZ13.K3(-3:C) IC33.8(C:O) U$1.14(CSW)
VDP-FLOP1: DZ14.A3(-3:A) IC28.8(D:O) IC29.11(CLK)
VDP-FLOP2: DZ14.A2(-2:A) IC28.6(C:O) IC30.11(CLK)
VDP-FLOP3: DZ14.A1(-1:A) IC28.10(E:O) IC31.11(CLK) IC32.22(!OE)
VDP-INT: DZ15.K4(-4:C) U$1.16(INT)
VDP-R/W: DZ13.K2(-2:C) IC28.11(E:I) IC31.1(OC) IC32.27(!WE) U$1.11(R/W)
VDP-RAS: DZ13.K1(-1:C) IC28.9(D:I) U$1.1(RAS)
VIN: IC5.1(VI) J1.2 SV2.33 SV4.33
WAIT: DZ1.K2(-2:C) DZ20.K1(-1:C) IC3.24(WAIT) IC35.10(W/!RDYA) IC35.30(W/!RDYB) IC38.10(W/RDYA) IC38.30(W/RDYB) R5.2 SV1.32 SV3.32
WR: CON1.35(/IOWR) DZ2.K3(-3:C) IC3.22(WR) IC33.10(C:I1) IC40.4(B:I0) IC47.2(A:I1) SV1.26 SV3.26
Unconnected: CON1.24(/IOCS16) CON1.25(/CD2) CON1.26(/CD1) CON1.27(D11) CON1.28(D12) CON1.29(D13) CON1.30(D14) CON1.31(D15) CON1.33(/VS1) CON1.37(INTRQ) CON1.40(/VS2) CON1.42(IORDY) CON1.43(/INPACK) CON1.47(D08) CON1.48(D09) CON1.49(D10) DZ8.A1(-1:A) DZ8.A3(-3:A) DZ8.A4(-4:A) DZ8.K1(-1:C) DZ8.K3(-3:C) DZ8.K4(-4:C) DZ15.A1(-1:A) DZ15.A2(-2:A) DZ15.A3(-3:A) DZ15.K1(-1:C) DZ15.K2(-2:C) DZ15.K3(-3:C) DZ21.A2(-2:A) DZ21.A3(-3:A) DZ21.A4(-4:A) DZ21.K2(-2:C) DZ21.K3(-3:C) DZ21.K4(-4:C) DZ22.A1(-1:A) DZ22.K1(-1:C) DZ25.A2(-2:A) DZ25.A3(-3:A) DZ25.A4(-4:A) DZ25.K2(-2:C) DZ25.K3(-3:C) DZ25.K4(-4:C) DZ26.A1(-1:A) DZ26.K1(-1:C) DZ27.A1(-1:A) DZ27.A2(-2:A) DZ27.A4(-4:A) DZ27.K1(-1:C) DZ27.K2(-2:C) DZ27.K4(-4:C) DZ28.A1(-1:A) DZ28.A2(-2:A) DZ28.A3(-3:A) DZ28.K1(-1:C) DZ28.K2(-2:C) DZ28.K3(-3:C) DZ29.A1(-1:A) DZ29.A2(-2:A) DZ29.A3(-3:A) DZ29.K1(-1:C) DZ29.K2(-2:C) DZ29.K3(-3:C) DZ30.A1(-1:A) DZ30.A2(-2:A) DZ30.A4(-4:A) DZ30.K1(-1:C) DZ30.K2(-2:C) DZ30.K4(-4:C) DZ35.A1(-1:A) DZ35.A2(-2:A) DZ35.A3(-3:A) DZ35.K1(-1:C) DZ35.K2(-2:C) DZ35.K3(-3:C) DZ36.A1(-1:A) DZ36.A2(-2:A) DZ36.A4(-4:A) DZ36.K1(-1:C) DZ36.K2(-2:C) DZ36.K4(-4:C) DZ37.A1(-1:A) DZ37.A2(-2:A) DZ37.A3(-3:A) DZ37.K1(-1:C) DZ37.K2(-2:C) DZ37.K3(-3:C) DZ38.A1(-1:A) DZ38.A2(-2:A) DZ38.A4(-4:A) DZ38.K1(-1:C) DZ38.K2(-2:C) DZ38.K4(-4:C) DZ39.A1(-1:A) DZ39.A3(-3:A) DZ39.A4(-4:A) DZ39.K1(-1:C) DZ39.K3(-3:C) DZ39.K4(-4:C) DZ41.A1(-1:A) DZ41.A2(-2:A) DZ41.A3(-3:A) DZ41.K1(-1:C) DZ41.K2(-2:C) DZ41.K3(-3:C) DZ46.A3(-3:A) DZ46.A4(-4:A) DZ46.K3(-3:C) DZ46.K4(-4:C) IC2.11(D:O) IC2.12(D:I0) IC2.13(D:I1) IC8.16(Q7) IC8.17(D7) IC8.18(D8) IC8.19(Q8) IC9.1(A:I) IC9.2(A:O) IC9.3(B:I) IC9.4(B:O) IC9.5(C:I) IC9.6(C:O) IC9.8(D:O) IC9.9(D:I) IC9.10(E:O) IC9.11(E:I) IC11.1(A:G) IC11.2(A:A1) IC11.3(B:Y4) IC11.4(A:A2) IC11.5(B:Y3) IC11.6(A:A3) IC11.8(A:A4) IC11.12(A:Y4) IC11.14(A:Y3) IC11.15(B:A3) IC11.16(A:Y2) IC11.17(B:A4) IC11.18(A:Y1) IC12.10(2C0) IC12.11(2C1) IC13.6(B:CLK) IC13.7(B:PRE) IC13.8(B:CLR) IC13.9(B:J) IC13.10(B:!Q) IC13.11(B:Q) IC13.12(B:K) IC13.14(A:!Q) IC14.4(B:I0) IC14.5(B:I1) IC14.6(B:O) IC14.8(C:O) IC14.9(C:I0) IC14.10(C:I1) IC14.11(D:O) IC14.12(D:I0) IC14.13(D:I1) IC15.2(1Q) IC15.3(1D) IC15.5(2Q) IC15.6(3Q) IC15.9(4Q) IC15.12(5Q) IC15.15(6Q) IC15.16(7Q) IC15.19(8Q) IC16.4(B:I0) IC16.5(B:I1) IC16.6(B:O) IC16.8(C:O) IC16.9(C:I0) IC16.10(C:I1) IC16.11(D:O) IC16.12(D:I0) IC16.13(D:I1) IC17.6(B:CLK) IC17.7(B:PRE) IC17.8(B:CLR) IC17.9(B:J) IC17.10(B:!Q) IC17.11(B:Q) IC17.12(B:K) IC17.15(A:Q) IC18.4(B:I0) IC18.5(B:I1) IC18.6(B:O) IC18.8(C:O) IC18.9(C:I0) IC18.10(C:I1) IC18.11(D:O) IC18.12(D:I0) IC18.13(D:I1) IC19.1(D:I) IC19.2(D:O) IC19.3(E:I) IC19.4(E:O) IC19.5(F:I) IC19.6(F:O) IC19.10(B:O) IC19.11(B:I) IC19.12(A:O) IC19.13(A:I) IC20.1(D:I) IC20.2(D:O) IC20.3(E:I) IC20.4(E:O) IC20.5(F:I) IC20.6(F:O) IC20.10(B:O) IC20.11(B:I) IC20.12(A:O) IC20.13(A:I) IC21.1(NC) IC23.16(7Q) IC23.19(8Q) IC27.1(A:I0) IC27.2(A:I1) IC27.3(A:O) IC27.11(D:O) IC27.12(D:I0) IC27.13(D:I1) IC28.12(F:O) IC28.13(F:I) IC29.19(1Q) IC30.19(1Q) IC33.1(A:I0) IC33.2(A:I1) IC33.3(A:O) IC33.11(D:O) IC33.12(D:I0) IC33.13(D:I1) IC34.1(C1+) IC34.2(V+) IC34.3(C1-) IC34.4(C2+) IC34.5(C2-) IC34.6(V-) IC34.7(T2OUT) IC34.8(R2IN) IC34.9(R2OUT) IC34.10(T2IN) IC34.11(T1IN) IC34.12(R1OUT) IC34.13(R1IN) IC34.14(T1OUT) IC35.5(INT) IC35.14(TXCA) IC35.15(TXDA) IC35.16(DTRA) IC35.17(RTSA) IC35.18(CTSA) IC35.23(CTSB) IC35.24(RTSB) IC35.25(DTRB) IC35.26(TXDB) IC35.35(CE) IC36.12(INT) IC37.1(A:I0) IC37.2(A:I1) IC37.3(A:O) IC37.4(B:I0) IC37.5(B:I1) IC37.6(B:O) IC37.8(C:O) IC37.9(C:I0) IC37.10(C:I1) IC37.11(D:O) IC37.12(D:I0) IC37.13(D:I1) IC38.17(RTSA) IC38.24(RTSB) IC38.25(DTRB) IC39.11(D:O) IC39.12(D:I0) IC39.13(D:I1) IC41.1(A:I0) IC41.2(A:I1) IC41.3(A:O) IC41.8(C:O) IC41.9(C:I0) IC41.10(C:I1) IC41.11(D:O) IC41.12(D:I0) IC41.13(D:I1) IC45.8(B:!Q) IC45.9(B:Q) IC45.10(B:PRE) IC45.11(B:CLK) IC45.12(B:D) IC45.13(B:CLR) IC46.1(A:I) IC46.2(A:O) IC46.3(B:I) IC46.4(B:O) IC46.5(C:I) IC46.6(C:O) IC46.8(D:O) IC46.9(D:I) IC46.10(E:O) IC46.11(E:I) IC47.8(C:O) IC47.9(C:I0) IC47.10(C:I1) IC47.11(D:O) IC47.12(D:I0) IC47.13(D:I1) IC49.1(A:I0) IC49.2(A:I1) IC49.3(A:O) IC49.11(D:O) IC49.12(D:I0) IC49.13(D:I1) IC50.1(QB) IC50.2(QC) IC50.3(QD) IC50.4(QE) IC50.5(QF) IC50.6(QG) IC50.7(QH) IC50.15(QA) IC51.1(QB) IC51.2(QC) IC51.3(QD) IC51.4(QE) IC51.5(QF) IC51.6(QG) IC51.7(QH) IC51.9(QH*) IC51.15(QA) IC52.1(D:I) IC52.2(D:O) IC52.8(C:O) IC52.9(C:I) IC52.10(B:O) IC52.11(B:I) IC52.12(A:O) IC52.13(A:I) IC53.3(E:I) IC53.4(E:O) IC53.5(F:I) IC53.6(F:O) IC53.8(C:O) IC53.9(C:I) IC54.3(E:I) IC54.4(E:O) IC54.5(F:I) IC54.6(F:O) IC55.4(B:I0) IC55.5(B:I1) IC55.6(B:O) IC55.8(C:O) IC55.9(C:I0) IC55.10(C:I1) IC55.11(D:O) IC55.12(D:I0) IC55.13(D:I1) IC56.1(D:I) IC56.2(D:O) IC56.3(E:I) IC56.4(E:O) IC56.8(C:O) IC56.9(C:I) IC56.10(B:O) IC56.11(B:I) IC56.12(A:O) IC56.13(A:I) IC57.1(A:I0) IC57.2(A:I1) IC57.3(A:O) IC57.4(B:I0) IC57.5(B:I1) IC57.6(B:O) IC57.8(C:O) IC57.9(C:I0) IC57.10(C:I1) IC58.4(B:I0) IC58.5(B:I1) IC58.6(B:O) IC58.8(C:O) IC58.9(C:I0) IC58.10(C:I1) IC58.11(D:O) IC58.12(D:I0) IC58.13(D:I1) IC59.1(A:I) IC59.2(A:O) IC59.3(B:I) IC59.4(B:O) IC59.5(C:I) IC59.6(C:O) IC59.8(D:O) IC59.9(D:I) IC59.10(E:O) IC59.11(E:I) IC60.3(B:Y4) IC60.5(B:Y3) IC60.7(B:Y2) IC60.9(B:Y1) IC60.11(B:A1) IC60.13(B:A2) IC60.15(B:A3) IC60.17(B:A4) IC60.19(B:G) IC61.4(B:I0) IC61.5(B:I1) IC61.6(B:O) IC61.8(C:O) IC61.9(C:I0) IC61.10(C:I1) IC61.11(D:O) IC61.12(D:I0) IC61.13(D:I1) IC62.18(D8) IC64.16(ASTB) IC64.17(BSTB) IC64.18(ARDY) IC64.21(BRDY) IC64.23(INT) IC66.2(QC) IC66.3(QD) IC66.4(QE) IC66.5(QF) IC66.6(QG) IC66.7(QH) IC66.9(QH*) IC68.4(B:I0) IC68.5(B:I1) IC68.6(B:O) IC68.8(C:O) IC68.9(C:I0) IC68.10(C:I1) IC68.11(D:O) IC68.12(D:I0) IC68.13(D:I1) IC69.3(E:I) IC69.4(E:O) IC69.8(C:O) IC69.9(C:I) J1.3 R6.1 R6.2 R16.3(E) S2.1(S) SV12.9 U$1.35(EXTV) U$1.37(GROMCLK) U$1.38(CPUCLK) U$2.LATCH U$2.NU1(NC1) U$2.NU2(NC2) U$3.LATCH U$3.NU1(NC1) U$3.NU2(NC2) X2.1 X2.4 X2.6 X2.7 X2.8 X2.9 X3.1 X3.4 X3.6 X3.7 X3.8 X3.9

## Buses
ADDRESS:A0,A1,A2,A3,A4,A5,A6,A7,A8,A9,A10,A11,A12,A13,A14,A15
DATA:D0,D1,D2,D3,D4,D5,D6,D7
DECODE:IO[0..15]
DB-DISPLAY:DB0,DB1,DB2,DB3,DB4,DB5,DB6,DB7
AD4,AD0,AD1,AD3,AD2,AD5,AD6,AD7
A-DATA:AD[0..7]
RD1,RD6,RD0,RD4,RD3,RD2,RD5,RD7
VA-DATA:VA[0..15]

## Notes on the sheet
- Pulse Clock | Clock Selector | 5V Regulator
- Monitor Leds | Pull Up Resitors
- Adjustable Clock
- IO Decoder
- Z80 CPU
- 2MHz Clock
- 4MHz Clock
- Dec. Capacitors
- Address Monitor Leds | Address Monitor Leds
- LO RAM 32KB | HI RAM 32KB | RAM 512KB
- Control Monitor Leds
- FLASH ROM 512KB
- Dec. Capacitors
- ROM 32KB
- Bank Switching Logic
- Top 32K memory is always RAM
  Bottoom 32K can be RAM or ROM
- 0x7X IO address
- Control Monitor Leds
- Upside | Backside
- Bank Switching Logic
- Dec. Capacitors
- Top 32K memory is always RAM
  Bottom 32K memory can be:
   - any 16 32K RAM banks
   - any 16 32K ROM banks
  After reset, bottom 32K is ROM
- 0x7X IO address
- V-DATA
- R-DATA
- A-DATA
- A-DATA
- R-DATA
- Dec. Capacitors
- Dec. Capacitors
- Dec. Capacitors
- Dec. Capacitors

## Power pins joined to a net without a drawn wire
GND: IC2.7(P:GND) IC4.12(GND) IC8.10(GND) IC9.7(P:GND) IC11.10(P:GND) IC12.8(GND) IC13.13(P:GND) IC14.7(P:GND) IC15.10(GND) IC16.7(P:GND) IC17.13(P:GND) IC18.7(P:GND) IC19.7(P:GND) IC20.7(P:GND) IC22.10(GND) IC23.10(GND) IC24.10(GND) IC25.10(GND) IC26.10(GND) IC27.7(P:GND) IC28.7(P:GND) IC29.10(GND) IC30.10(GND) IC31.10(GND) IC33.7(P:GND) IC34.15(GND) IC37.7(P:GND) IC39.7(P:GND) IC40.7(P:GND) IC41.7(P:GND) IC42.10(GND) IC43.10(GND) IC44.10(GND) IC45.7(P:GND) IC46.7(P:GND) IC47.7(P:GND) IC48.16(GND) IC49.7(P:GND) IC50.8(GND) IC51.8(GND) IC52.7(P:GND) IC53.7(P:GND) IC54.7(P:GND) IC55.7(P:GND) IC56.7(P:GND) IC57.7(P:GND) IC58.7(P:GND) IC59.7(P:GND) IC60.10(P:GND) IC61.7(P:GND) IC62.10(GND) IC63.10(GND) IC65.8(GND) IC66.8(GND) IC67.7(P:GND) IC68.7(P:GND) IC69.7(P:GND)
GND1: CON1.1(GND1)
GND2: CON1.50(GND2)
VCC: IC2.14(P:VCC) IC4.24(VCC) IC8.20(VCC) IC9.14(P:VCC) IC11.20(P:VCC) IC12.16(VCC) IC13.5(P:VCC) IC14.14(P:VCC) IC15.20(VCC) IC16.14(P:VCC) IC17.5(P:VCC) IC18.14(P:VCC) IC19.14(P:VCC) IC20.14(P:VCC) IC22.20(VCC) IC23.20(VCC) IC24.20(VCC) IC25.20(VCC) IC26.20(VCC) IC27.14(P:VCC) IC28.14(P:VCC) IC29.20(VCC) IC30.20(VCC) IC31.20(VCC) IC33.14(P:VCC) IC34.16(VCC) IC37.14(P:VCC) IC39.14(P:VCC) IC40.14(P:VCC) IC41.14(P:VCC) IC42.20(VCC) IC43.20(VCC) IC44.20(VCC) IC45.14(P:VCC) IC46.14(P:VCC) IC47.14(P:VCC) IC48.32(VCC) IC49.14(P:VCC) IC50.16(VCC) IC51.16(VCC) IC52.14(P:VCC) IC53.14(P:VCC) IC54.14(P:VCC) IC55.14(P:VCC) IC56.14(P:VCC) IC57.14(P:VCC) IC58.14(P:VCC) IC59.14(P:VCC) IC60.20(P:VCC) IC61.14(P:VCC) IC62.20(VCC) IC63.20(VCC) IC65.16(VCC) IC66.16(VCC) IC67.14(P:VCC) IC68.14(P:VCC) IC69.14(P:VCC)
VCC1: CON1.38(VCC1)
VCC2: CON1.13(VCC2)

## Library data of the parts
C1 C11 C12 = rcl:CPOL-EU: POLARIZED CAPACITOR, European symbol; SPICEPREFIX: C
C2-C7 C13-C21 C27-C37 C39-C70 = capacitor-wima:C: CAPACITOR naming: grid - package width
CLK-SELECT = special:SW_DIP-2: DIP SWITCH
CON1 = con-hirose:CF-CARD-IDE_MODE: Compact Flash Adapter Type I or II without Eject Button Source: con-hirose.lbr from Bob Starr <rtzaudio@mindspring.com>; OC_FARNELL: unknown; OC_NEWARK: unknown
D3-D6 = diode:BAV17: DIODE silicon-epitaxial planar diode
DZ1-DZ8 DZ13-DZ15 DZ17-DZ46 = led:LZR184: LED BLOCK 4 LEDs, Siemens
IC1 IC10 = linear:*555: TIMER
IC2 IC39 = 74xx-eu:74*00: Quad 2-input NAND gate
IC3 = zilog:Z80CPU: Z80 FAMILY DEVICE
IC4 = 74xx-eu:74*154: 4-line to 16-line data SELECTOR/MULTIPLEXER
IC5 = linear:78*: Positive VOLTAGE REGULATOR Source: http://cache.national.com/ds/LM/LM78L05.pdf http://www.fairchildsemi.com/ds/LM/LM7805.pdf
IC6 IC7 IC32 = memory-hitachi:62256P: MEMORY; OC_FARNELL: unknown; OC_NEWARK: unknown
IC8 IC22 IC24 IC44 IC62 IC63 = 74xx-eu:74*273: Octal D type FLIP FLOP, clear
IC9 IC28 IC46 IC59 = 74xx-eu:74*04: Hex INVERTER
IC11 IC60 = 74xx-eu:74*244: Octal BUFFER and LINE DRIVER, 3-state
IC12 = 74xx-eu:74*153: Dual 4-line to 1-line data SELECTOR/MULTIPLEXER
IC13 IC17 = 74xx-eu:74*76: Dual J-K FLIP FLOP, preset and clear
IC14 IC16 IC18 IC27 IC33 IC37 IC40 IC41 IC47 IC49 IC57 IC58 = 74xx-eu:74*32: Quad 2-input OR gate
IC15 IC42 IC43 = 74xx-eu:74*374: Octal D type transparent LATCH, edge triggered
IC19 IC20 IC52-IC54 IC56 IC67 IC69 = 74xx-eu:74*14: Hex schmitt trigger INVERTER
IC21 = memory-hitachi:628128P: MEMORY; OC_FARNELL: unknown; OC_NEWARK: unknown
IC23 = 74xx-eu:74*377: Octal D type FLIP FLOP, enable
IC25 IC26 = 74xx-eu:74*541: Octal BUFFER and LINE DRIVER, 3-state
IC29-IC31 = 74xx-us:74*574: 8-bit D type FLIP FLOP bus driver
IC34 = maxim:MAX3232*: True RS-232 Transceivers 3.0V to 5.5V, Low-Power up to 1Mbps, Using Four 0.1µF External Capacitors Source: http://pdfserv.maxim-ic.com/en/ds/MAX3222-MAX3241.pdf; MF: MAXIM; MPN: MAX3232CPE+; OC_FARNELL: 9724494; OC_NEWARK: 68K4626
IC35 = zilog:Z80SIO: Z80 FAMILY DEVICE
IC36 = zilog:Z80CTC: Z80 FAMILY DEVICE
IC38 = zilog:Z80DART: Z80 FAMILY DEVICE
IC45 = 74xx-eu:74*74: Dual D type positive edge triggered FLIP FLOP, preset and clear
IC48 = am29-memory:AM29F040P: 4-Megabit FLASH MEMORY (512 K x 8 bit) 5 V-only
IC50 IC51 IC65 IC66 = 74xx-eu:74*595: 8-bit SHIFT REGISTER, output latch
IC55 IC68 = 74xx-eu:74*86: Quad 2-input EXCLUSIVE-OR (XOR) gate
IC61 = 74xx-eu:74*08: Quad 2-input AND gate
IC64 = zilog:Z80PIO: Z80 FAMILY DEVICE
J1 = con-jack:DCJ0202: DC POWER JACK Source: DCJ0202.pdf; OC_FARNELL: unknown; OC_NEWARK: unknown
J2 = jumper:J2: Jumper switch 2 x 2.5 mm
JP2 JP3 = pinhead:PINHD-1X4: PIN HEADER
JP4 = pinhead:PINHD-1X8: PIN HEADER
JP5 JP6 = jumper:JP1E: JUMPER
LED2 = hacesoft:LED: LED OSRAM: - CHIPLED LG R971, LG N971, LY N971, LG Q971, LY Q971, LO R971, LY R971 LH N974, LH R974 LS Q976, LO Q976, LY Q976 LO Q996 - Hyper CHIPLED LW Q18S LB Q993, LB Q99A, LB R99A - SideLED LS A670, LO A670, LY A670, LG A670, LP A670 LB A673, LV A673, LT A673, LW A673 LH A674 LY A675 LS A676, LA A676, LO A676, LY A676, LW A676 LS A679, LY A679, LG A679 - Hyper Micro SIDELED® LS Y876, LA Y876, LO Y876, LY Y876 LT Y87S - SmartLED LW L88C, LW L88S LB L89C, LB L89S, LG L890 LS L89K, LO L89K, LY L89K LS L896, LA L896, LO L896, LY L896 - TOPLED LS T670, LO T670, LY T670, LG T670, LP T670 LSG T670, LSP T670, LSY T670, LOP T670, LYG T670 LG T671, LOG T671, LSG T671 LB T673, LV T673, LT T673, LW T673 LH T674 LS T676, LA T676, LO T676, LY T676, LB T676, LH T676, LSB T676, LW T676 LB T67C, LV T67C, LT T67C, LS T67K, LO T67K, LY T67K, LW E67C LS E67B, LA E67B, LO E67B, LY E67B, LB E67C, LV E67C, LT E67C LW T67C LS T679, LY T679, LG T679 LS T770, LO T770, LY T770, LG T770, LP T770 LB T773, LV T773, LT T773, LW T773 LH T774 LS E675, LA E675, LY E675, LS T675 LS T776, LA T776, LO T776, LY T776, LB T776 LHGB T686 LT T68C, LB T68C - Hyper Mini TOPLED® LB M676 - Mini TOPLED Santana® LG M470 LS M47K, LO M47K, LY M47K Source: http://www.osram.convergy.de/
Q1-Q3 = special:XTAL/S: CRYSTAL
R1-R6 R8-R15 R18 R20-R22 R26-R96 = rcl:R-EU_: RESISTOR, European symbol; SPICEPREFIX: R
R16 R24 R25 = resistor:R-TRIMM: Trimm resistor
S2 = switch-omron:10-XX: OMRON SWITCH; MPN: B3F-1000; OC_FARNELL: 176432; OC_NEWARK: 36M3542
SV1-SV4 = con-lstb:MA18-2: PIN HEADER; OC_FARNELL: unknown; OC_NEWARK: unknown
SV8-SV12 SV15 = con-lstb:MA06-2: PIN HEADER; OC_FARNELL: unknown; OC_NEWARK: unknown
SV13 SV14 = con-lstb:MA05-2: PIN HEADER; OC_FARNELL: unknown; OC_NEWARK: unknown
T1 = transistor:2N3904: NPN TRANSISTOR
U1 = Alliance_Memory_By_element14_Batch_1:AS6C4008-55PCN: CMOS SRAM; MPN: AS6C4008-55PCN; OC_FARNELL: 1562900; OC_NEWARK: 94M6217; PACKAGE: DIP-32; SUPPLIER: ALLIANCE MEMORY
U$1 = TMS9918A:TMS9918A
U$2 U$3 = YanLibrary:SNES-CONTROLLER
X2 X3 = con-subd:F09VP: SUB-D; OC_FARNELL: unknown; OC_NEWARK: unknown
X4 = con-yamaichi:MDIN04K: YAMAICHI CONNECTOR; OC_FARNELL: unknown; OC_NEWARK: unknown